# Altium project RD3399-20181013.PRJPCB
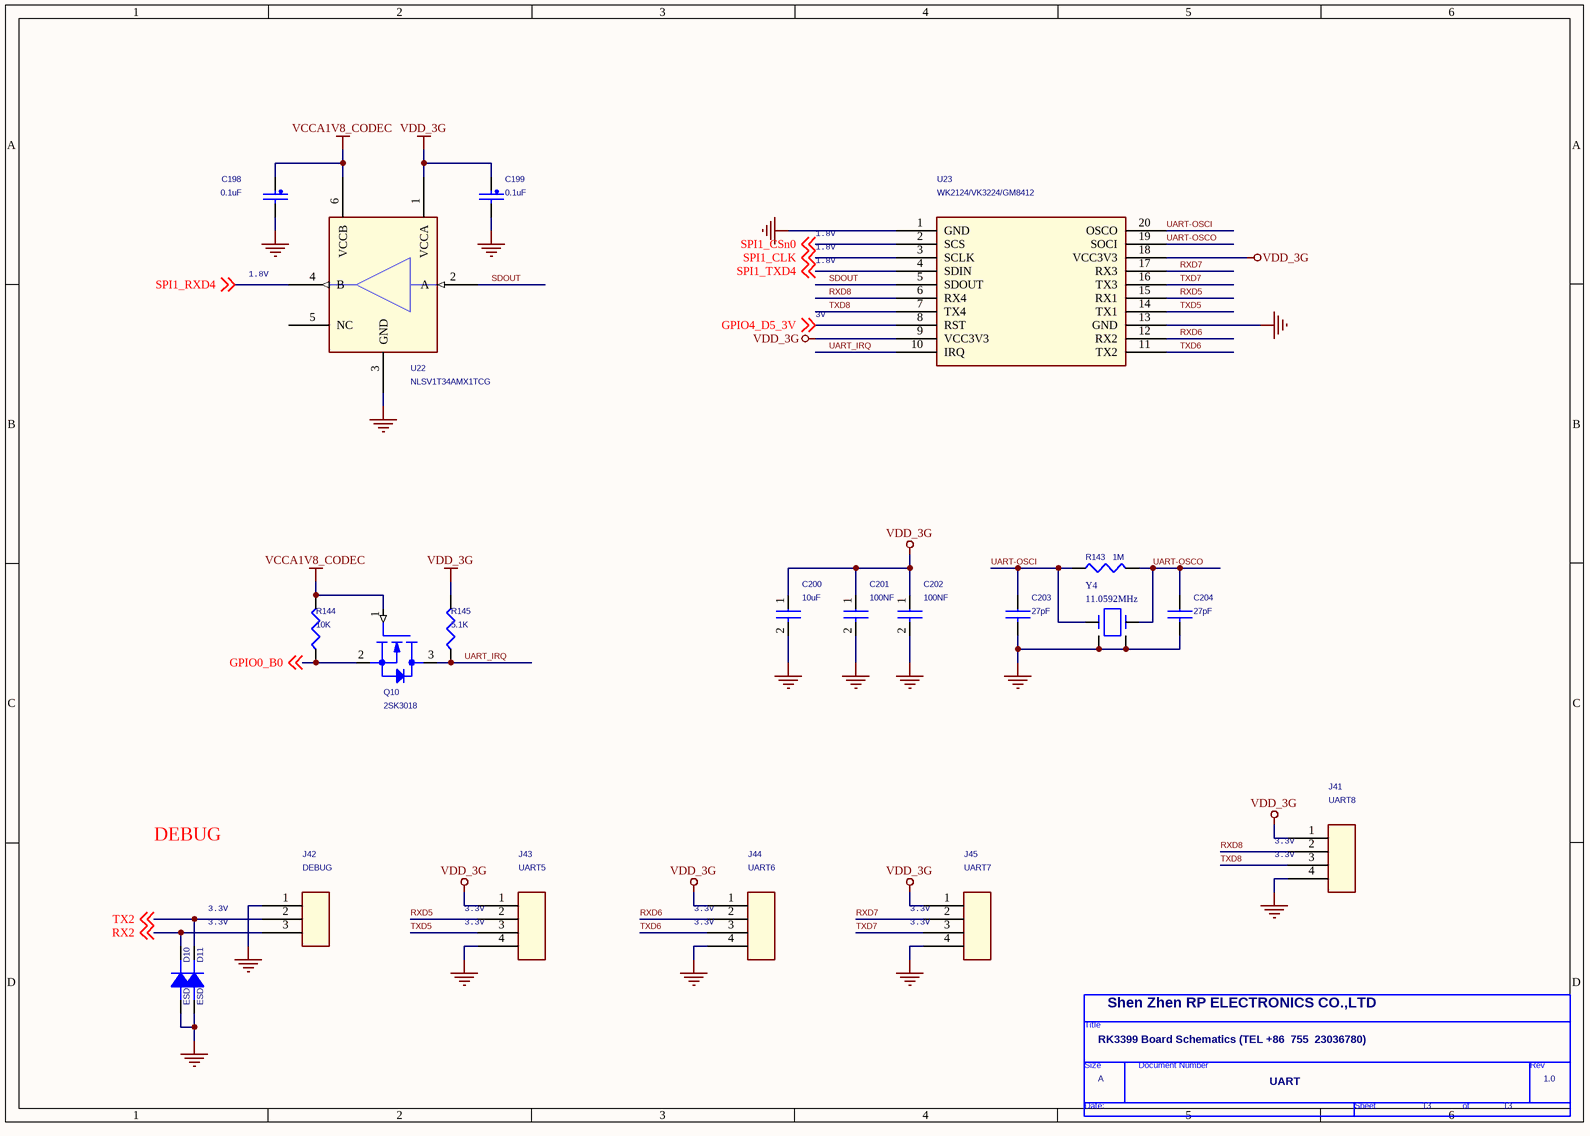
[diagram p0: 13.SchDoc]
7 sheets, 222 parts. Net scope: global (net labels, ports and power ports of the same name join across sheets).
Board file: RD3399-20181026.PCBDOC
Sheets:
  13.SchDoc
  09.SchDoc
  07.SchDoc
  04.SchDoc
  03.SchDoc
  02.SchDoc
  01.SchDoc

## Sheet 13.SchDoc
size 297 x 209 mm

### Parts
(Parts that share a designator on the sheet are numbered #1, #2 ... from top to bottom, then left to right.)
*#1  Doc: UART  RevCode: 1.0  Title: RK3399 Board Schematics (TEL +86  755  23036780)  Page Size: A  Page Number: 13  Cage Code: Shen Zhen RP ELECTRONICS CO.,LTD  (hidden comment: TitleBlock0)  (graphical)
C198  0.1uF  [0805C]
C199  0.1uF  [0805C]
C200  10uF  [0805C]
C201  100NF  [0805C]
C202  100NF  [0805C]
C203  27pF  [0805C]
C204  27pF  [0805C]
D10  ESD  [SOD-323]
D11  ESD  [SOD-323]
J41  UART8  [sip-4p-2d0]
J42  DEBUG  [SIP-3P-2D54-DEBUG]
J43  UART5  [sip-4p-2d0]
J44  UART6  [sip-4p-2d0]
J45  UART7  [sip-4p-2d0]
Q10  2SK3018  [SOT-23]
R143  1M  [0805]
R144  10K  [0805]
R145  5.1K  [0805]
U22  NLSV1T34AMX1TCG  [ullga6_1p45x1_0p5mm]
U23  WK2124/VK3224/GM8412  [WK2124]
Y4  11.0592MHz  [Y3025]

### Nets
GND: C198.2 C199.2 C200.2 C201.2 C202.2 C203.2 C204.2 D10.1(A) D11.1(A) J41.4 J42.1 J43.4 J44.4 J45.4 U22.3(GND) U23.1(GND) U23.13(GND) Y4.2 Y4.4
VCCA1V8_CODEC: C198.1 Q10.1(GATE) R144.1 U22.6(VCCB)
VDD_3G: C199.1 C200.1 C201.1 C202.1 J41.1 J43.1 J44.1 J45.1 R145.1 U22.1(VCCA) U23.9(VCC3V3) U23.18(VCC3V3)
GPIO0_B0: Q10.2(SOURCE) R144.2 ; off-sheet GPIO0_B0
GPIO4_D5_3V: U23.8(RST) ; off-sheet GPIO4_D5_3V
RX2: D10.2(K) J42.3 ; off-sheet RX2
RXD5: J43.2 U23.15(RX1)
RXD6: J44.2 U23.12(RX2)
RXD7: J45.2 U23.17(RX3)
RXD8: J41.2 U23.6(RX4)
SDOUT: U22.2(A) U23.5(SDOUT)
SPI1_CLK: U23.3(SCLK) ; off-sheet SPI1_CLK
SPI1_CSn0: U23.2(SCS) ; off-sheet SPI1_CSn0
SPI1_RXD4: U22.4(B) ; off-sheet SPI1_RXD4
SPI1_TXD4: U23.4(SDIN) ; off-sheet SPI1_TXD4
TX2: D11.2(K) J42.2 ; off-sheet TX2
TXD5: J43.3 U23.14(TX1)
TXD6: J44.3 U23.11(TX2)
TXD7: J45.3 U23.16(TX3)
TXD8: J41.3 U23.7(TX4)
UART-OSCI: C203.1 R143.2 U23.20(OSCO) Y4.1
UART-OSCO: C204.1 R143.1 U23.19(SOCI) Y4.3
UART_IRQ: Q10.3(DRAIN) R145.2 U23.10(IRQ)

Not connected (* = marked no-connect by the designer): U22 5(NC)

### Notes on the sheet
- 1.8V
- 3V
- DEBUG
- (near J41) 3.3V
- 3.3V
- (near J43) 3.3V
- (near J44) 3.3V
- (near J45) 3.3V
- (in symbol TitleBlock0) Title; Size; Document Number; Rev; Date:; Sheet; of

### Library data of the parts
C198 = CAP_NP: CAP CER 0.22UF 6.3V 20% X5R 0201; CLASS: DISCRETE; SIGNAL_MODEL: DEFAULT_CAPACITOR_220000pF_2_1; ROOM: CPU; AGILE_PN: 150-77852; MFG_NAME01: TAIYO YUDEN; MFG_PN01: JMK063BJ224MP-F; CAD_APPROVED: Yes; FPLIST: CC0201,CC0201_HD,0201_CC,cc_0201_cir; PRIORITY_PN: 021-00278; Tolerance: 20%; ROHS: Yes; HEIGHT: 0.33 MM; WVDC: 6.3V; VOLTAGE: 6.3V
C199 = CAP_NP: CAP CER 0.22UF 10V 20% X5R 0201; CLASS: DISCRETE; ROOM: CPU; AGILE_PN: 150-78815; MFG_NAME01: Taiyo Yuden; MFG_PN01: LMK063BJ224MP-F; CAD_APPROVED: Yes; FPLIST: CC0201,CC0201_HD,0201_CC,CC_0201_CIR,0201_CC_012SM; PRIORITY_PN: 021-00278; SIGNAL_MODEL: DEFAULT_CAPACITOR_220000pF_2_1; VOLTAGE: 10V; Tolerance: 20%; ROHS: Yes; HEIGHT: 0.33MM; WVDC: 10V
C200 = CAP NP_Dup2: cap,10.00uF,+/-10%,10V,X5R,C0805; Manufacturer: TDK; RK PN: C2012X5R1A106K125AB; Priority: A; Tolerance: 10%; Voltage: 10V; Dielectric: X5R; Part Type: C0805; Manufacturer PN: C2012X5R1A106K125AB; Created by: JJJ
C201 C202 = CAP NP_Dup2: cap,100.00nF,+/-10%,16V,X5R,C0402; Manufacturer PN: C1005X5R1C104K050BA; Manufacturer: TDK; Tolerance: 10%; Priority: A; Voltage: 16V; Dielectric: X5R; Created by: JJJ; Part Type: C0402; RK PN: C1005X5R1C104K050BA
C203 C204 = CAP NP_3_Dup1
D10 D11 = DIODE_Dup2
J41 J43-J45 = CON4
J42 = CON4_1
Q10 = 2N6756_0
R143 = RES_0
R144 R145 = R_Dup1
U22 = NLSV1T34: IC VXLTR 1 BIT DUAL-SUPPLY 0.9-4.5V 613AF; AGILE_PN: 312-79552; MFG_NAME01: On Semiconductor; CAD_APPROVED: Yes; CLASS: IC; MFG_PN01: NLSV1T34AMX1TCG; ROHS: Yes; HEIGHT: 0.4MM
Y4 = CRYSTAL_2
*#1 = TitleBlock0: Page Create Date: March  8, 1995; Page Count: 13

## Sheet 09.SchDoc
size 513 x 386 mm
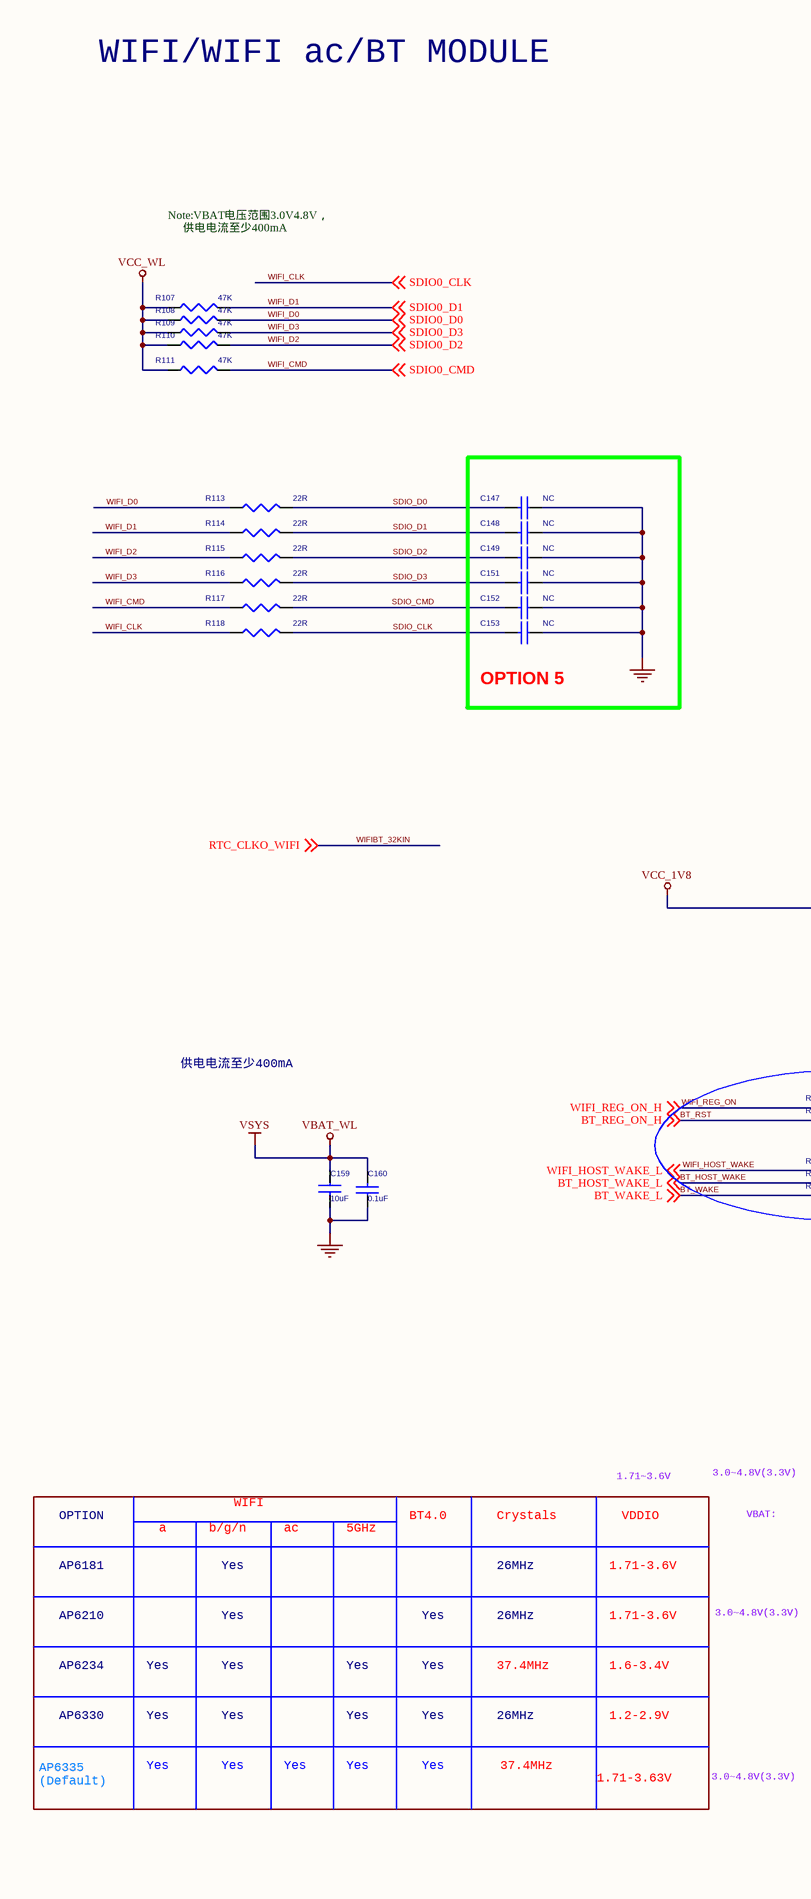
[diagram p1: 09.SchDoc, left]
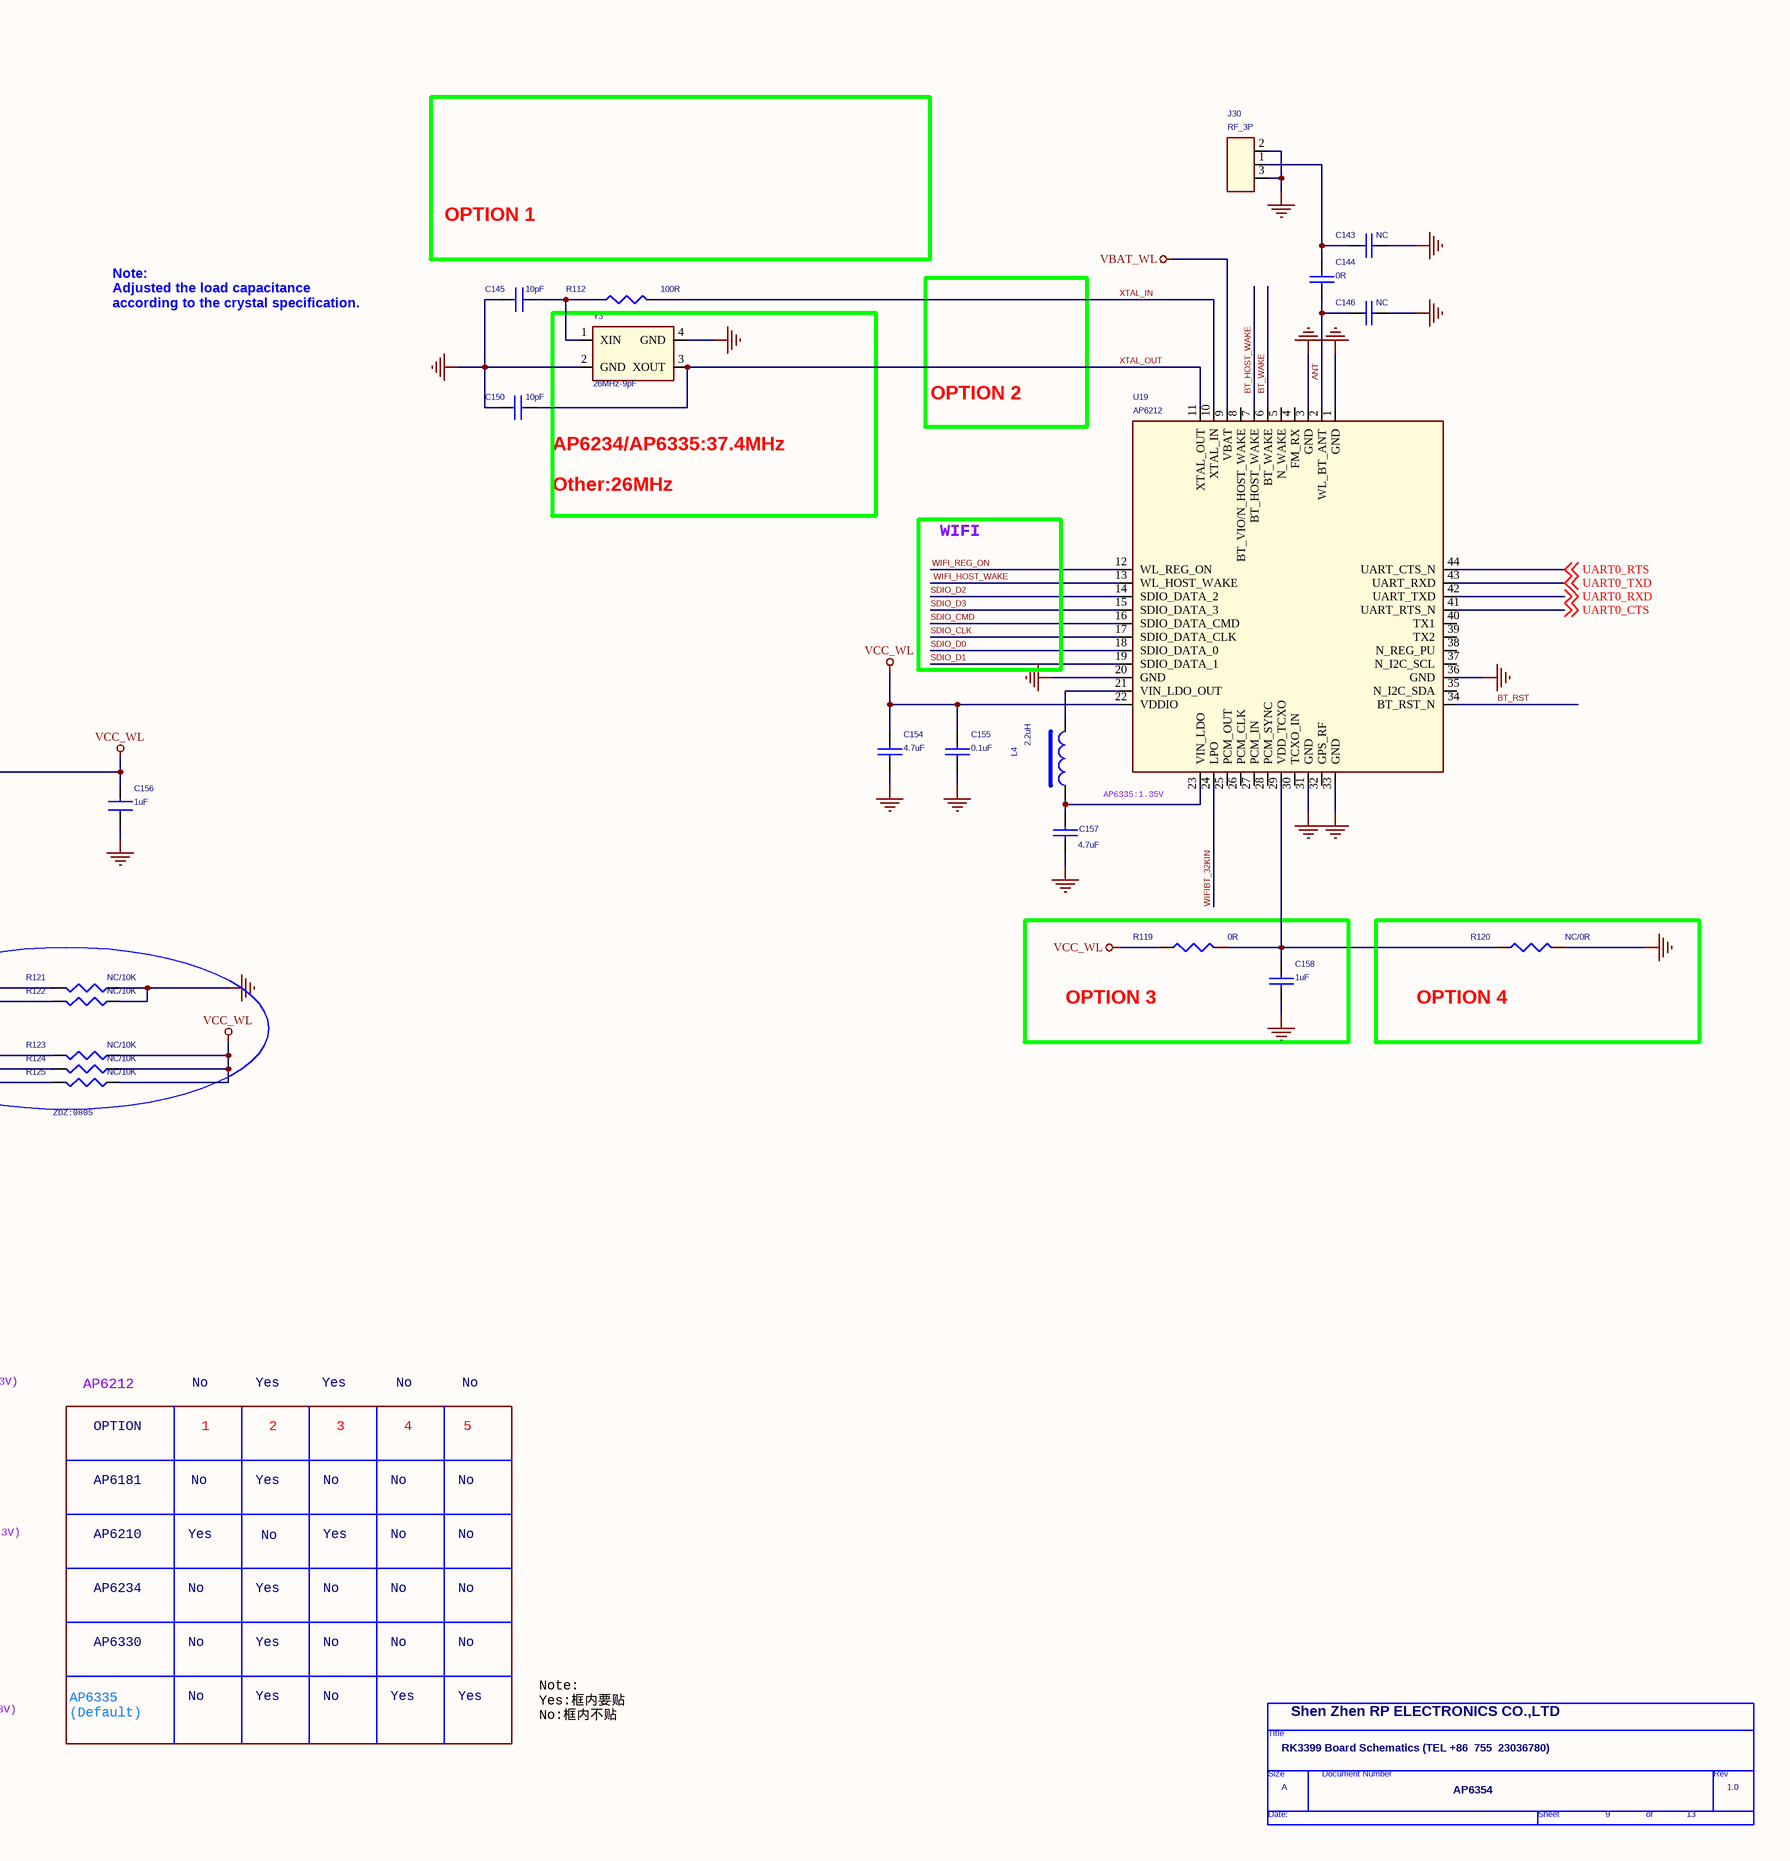
[diagram p2: 09.SchDoc, right]

### Parts
(Parts that share a designator on the sheet are numbered #1, #2 ... from top to bottom, then left to right.)
*#2  Doc: AP6354  RevCode: 1.0  Title: RK3399 Board Schematics (TEL +86  755  23036780)  Page Size: A  Page Number: 9  Page Count: 13  Cage Code: Shen Zhen RP ELECTRONICS CO.,LTD  (hidden comment: TitleBlock0)  (graphical)
C143  NC  [0805C]
C144  0R  [0805C]
C145  10pF  [0805C]
C146  NC  [0805C]
C147  NC  [0805C]
C148  NC  [0805C]
C149  NC  [0805C]
C150  10pF  [0805C]
C151  NC  [0805C]
C152  NC  [0805C]
C153  NC  [0805C]
C154  4.7uF  [0805C]
C155  0.1uF  [0805C]
C156  1uF  [0805C]
C157  4.7uF  [0805C]
C158  1uF  [0805C]
C159  10uF  [0805C]
C160  0.1uF  [0805C]
J30  RF_3P  [ANT-2]
L4  2.2uH  [IND2520]
R107  47K  [0805]
R108  47K  [0805]
R109  47K  [0805]
R110  47K  [0805]
R111  47K  [0805]
R112  100R  [0805]
R113  22R  [0805]
R114  22R  [0805]
R115  22R  [0805]
R116  22R  [0805]
R117  22R  [0805]
R118  22R  [0805]
R119  0R  [0805]
R120  NC/0R  [0805]
R121  NC/10K  [0805]
R122  NC/10K  [0805]
R123  NC/10K  [0805]
R124  NC/10K  [0805]
R125  NC/10K  [0805]
U19  AP6212  [AP6XXX]
Y3  26MHz-9pF  [CRY-3225]

### Blocks framed on the sheet
OPTION 5: C147-C149 C151-C153
OPTION 3: C158 R119
OPTION 4: R120

### Nets
GND: C143.2 C145.2 C146.2 C147.1 C148.1 C149.1 C150.1 C151.1 C152.1 C153.1 C154.1 C155.1 C156.2 C157.1 C158.1 C159.2 C160.1 J30.2 J30.3 R120.1 R121.1 R122.1 U19.1(GND) U19.3(GND) U19.20(GND) U19.31(GND) U19.33(GND) U19.36(GND) Y3.2(GND) Y3.4(GND)
VBAT_WL: C159.1 C160.2 U19.9(VBAT)  [also labelled VSYS]
VCC_1V8: C154.2 C155.2 C156.1 R107.1 R108.1 R109.1 R110.1 R111.1 R119.2 R123.1 R124.1 R125.1 U19.22(VDDIO)  [also labelled VCC_WL]
ANT: C144.1 C146.1 U19.2(WL_BT_ANT)
BT_HOST_WAKE: R124.2 U19.7(BT_HOST_WAKE) ; off-sheet BT_HOST_WAKE_L  [also labelled BT_HOST_WAKE_L]
BT_RST: R122.2 U19.34(BT_RST_N) ; off-sheet BT_REG_ON_H  [also labelled BT_REG_ON_H]
BT_WAKE: R125.2 U19.6(BT_WAKE) ; off-sheet BT_WAKE_L  [also labelled BT_WAKE_L]
SDIO_CLK: C153.2 R118.2 U19.17(SDIO_DATA_CLK)
SDIO_CMD: C152.2 R117.2 U19.16(SDIO_DATA_CMD)
SDIO_D0: C147.2 R113.2 U19.18(SDIO_DATA_0)
SDIO_D1: C148.2 R114.2 U19.19(SDIO_DATA_1)
SDIO_D2: C149.2 R115.2 U19.14(SDIO_DATA_2)
SDIO_D3: C151.2 R116.2 U19.15(SDIO_DATA_3)
UART0_CTS: U19.41(UART_RTS_N) ; off-sheet UART0_CTS
UART0_RTS: U19.44(UART_CTS_N) ; off-sheet UART0_RTS
UART0_RXD: U19.42(UART_TXD) ; off-sheet UART0_RXD
UART0_TXD: U19.43(UART_RXD) ; off-sheet UART0_TXD
WIFI_CLK: R118.1 ; off-sheet SDIO0_CLK  [also labelled SDIO0_CLK]
WIFI_CMD: R111.2 R117.1 ; off-sheet SDIO0_CMD  [also labelled SDIO0_CMD]
WIFI_D0: R108.2 R113.1 ; off-sheet SDIO0_D0  [also labelled SDIO0_D0]
WIFI_D1: R107.2 R114.1 ; off-sheet SDIO0_D1  [also labelled SDIO0_D1]
WIFI_D2: R110.2 R115.1 ; off-sheet SDIO0_D2  [also labelled SDIO0_D2]
WIFI_D3: R109.2 R116.1 ; off-sheet SDIO0_D3  [also labelled SDIO0_D3]
WIFI_HOST_WAKE: R123.2 U19.13(WL_HOST_WAKE) ; off-sheet WIFI_HOST_WAKE_L  [also labelled WIFI_HOST_WAKE_L]
WIFI_REG_ON: R121.2 U19.12(WL_REG_ON) ; off-sheet WIFI_REG_ON_H  [also labelled WIFI_REG_ON_H]
WIFIBT_32KIN: U19.24(LPO) ; off-sheet RTC_CLKO_WIFI  [also labelled RTC_CLKO_WIFI]
XTAL_IN: R112.2 U19.10(XTAL_IN)
XTAL_OUT: C150.2 U19.11(XTAL_OUT) Y3.3(XOUT)
NetC143_1: C143.1 C144.2 J30.1
NetC145_1: C145.1 R112.1 Y3.1(XIN)
NetC157_2: C157.2 L4.1 U19.23(VIN_LDO)
NetC158_2: C158.2 R119.1 R120.2 U19.29(VDD_TCXO)
NetL4_2: L4.2 U19.21(VIN_LDO_OUT)

Not connected (* = marked no-connect by the designer): U19 4(FM_RX) 5(N_WAKE) 8(BT_VIO/N_HOST_WAKE) 25(PCM_OUT) 26(PCM_CLK) 27(PCM_IN) 28(PCM_SYNC) 30(TCXO_IN) 32(GPS_RF) 35(N_I2C_SDA) 37(N_I2C_SCL) 38(N_REG_PU) 39(TX2) 40(TX1)

### Notes on the sheet
- WIFI/WIFI ac/BT MODULE
- Note:VBAT电压范围3.0V4.8V，
  供电电流至少400mA
- OPTION 1
- (near C145) Note:
  Adjusted the load capacitance
  according to the crystal specification.
- OPTION 2
- Other:26MHz
- (near C150) AP6234/AP6335:37.4MHz
- WIFI
- (near U19) AP6335:1.35V
- 供电电流至少400mA
- ZDZ:0805
- 1.71~3.6V
- 3.0~4.8V(3.3V)
- AP6212
- No
- Yes
- OPTION
- a
- b/g/n
- ac
- 5GHz
- BT4.0
- Crystals
- VDDIO
- VBAT:
- 1
- 2
- 3
- 4
- 5
- AP6181
- 26MHz
- 1.71-3.6V
- AP6234
- AP6210
- 37.4MHz
- 1.6-3.4V
- AP6330
- 1.2-2.9V
- AP6335
  (Default)
- 1.71-3.63V
- Note:
  Yes:框内要贴
  No:框内不贴
- (in symbol TitleBlock0) Title; Size; Document Number; Rev; Date:; Sheet; of

### Library data of the parts
C143 C144 C146 C154 C155 C157 C158 = CAPNP_Dup1_1
C145 C150 = CAP NP: CAP,MLCC,8pF,+/-0.5pF,NPO,6.3V,SMD0402
C147-C149 C151-C153 C160 = CAP NP: CAP,MLCC,100nF,+/-10%,X7R,6.3V,SMD0402; Supplier: MURATA; Supplier P/N: GRM21BR61C106K
C156 = CAP NP_Dup6: CAP,MLCC,100nF,+/-10%,X7R,6.3V,SMD0402
C159 = CAP NP: CAP,MLCC,4.7uF,+/-10%,X5R,6.3V,SMD0603; Supplier P/N: GRM21BR61C106K; Supplier: MURATA
J30 = CON3_1
L4 = INDUCTOR_1_Dup1: CoilInd,Shielded(SHLD),2.2uH@100KHz,+/-30%,1.09A,110mOhm,SMD,3.0*3.0*1.0; ROOM: USB+5V
R107-R111 = RESISTOR_Dup2: ROHS CHIP RES 10K 1/16W +/-5%
R112 = R_0
R113-R120 = RESISTOR_Dup2: RES,thick film,33Ohm,+/-5%,1/16W,SMD0402
R121-R125 = RESISTOR_1
U19 = AP6493_1: Device: AMPAK_SIP; QVL: AMPAK; ORCAD_LIB: MODULE
Y3 = CRYSTAL-4_4: Crystal,37.400MHz,+/-20ppm,12pF,SMD3225,-10°C ~ +60   °C
*#2 = TitleBlock0: Page Create Date: March  8, 1995

## Sheet 07.SchDoc
size 297 x 209 mm
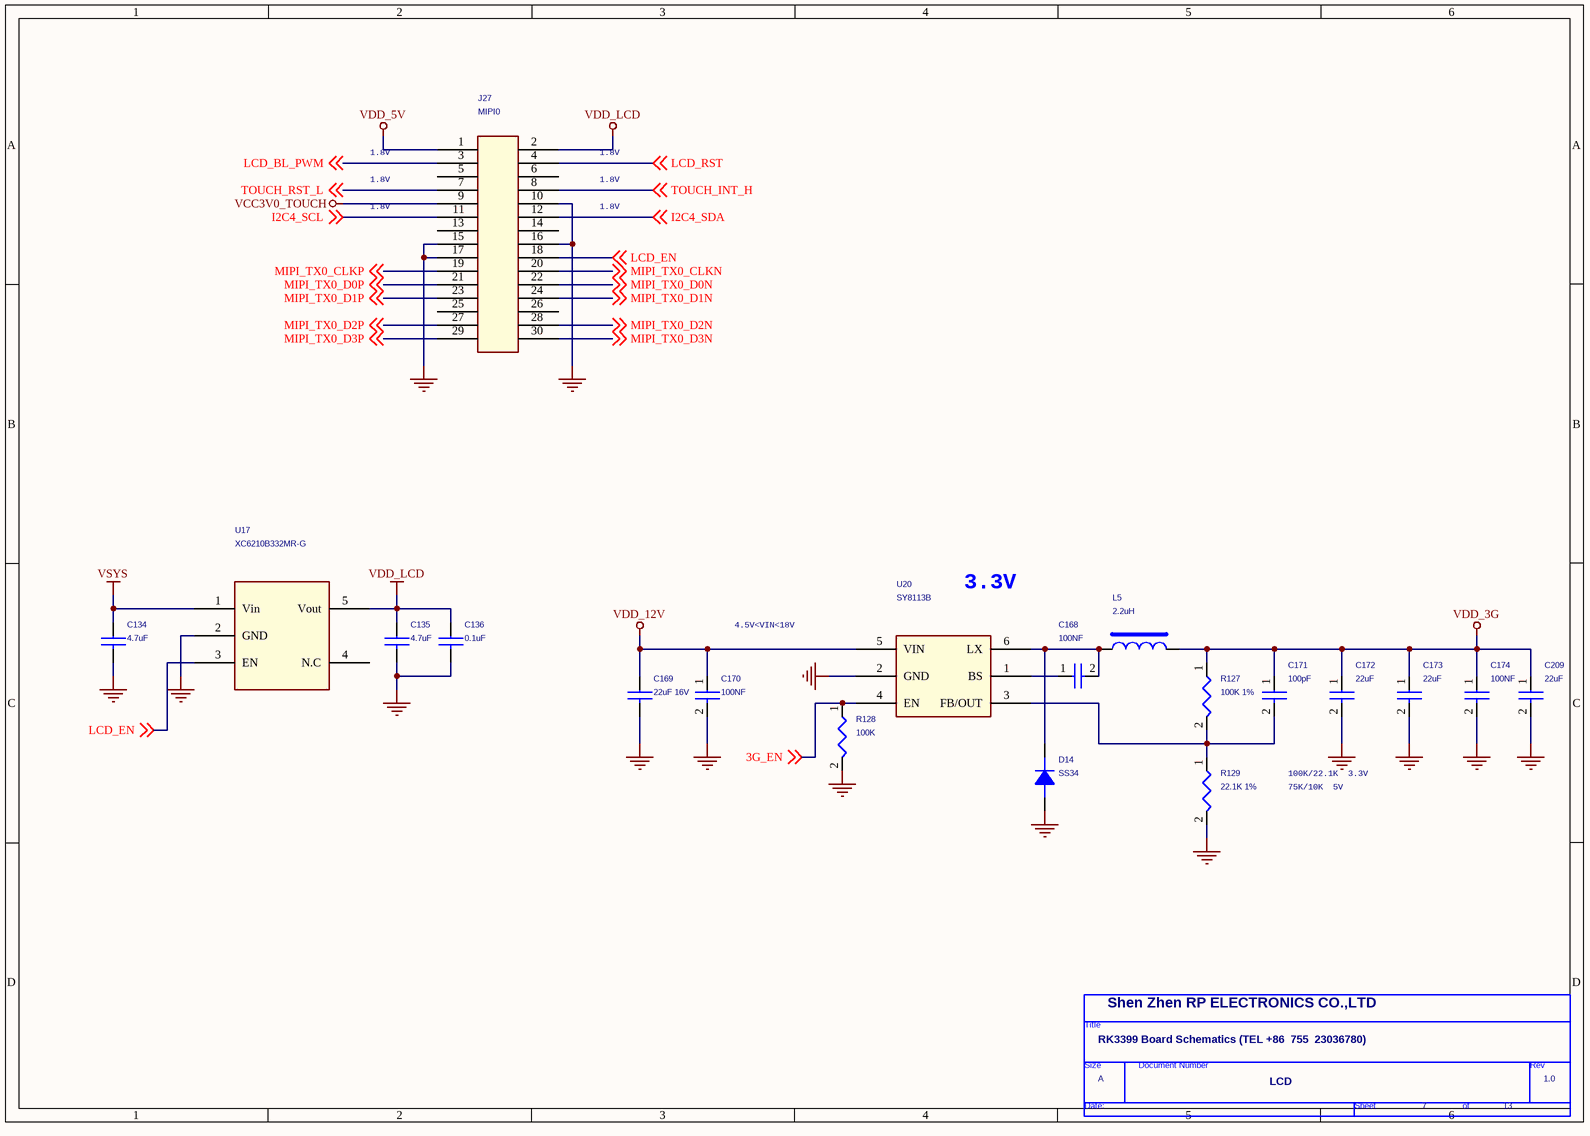
[diagram p3: 07.SchDoc]

### Parts
(Parts that share a designator on the sheet are numbered #1, #2 ... from top to bottom, then left to right.)
*#3  Doc: LCD  RevCode: 1.0  Title: RK3399 Board Schematics (TEL +86  755  23036780)  Page Size: A  Page Number: 7  Page Count: 13  Cage Code: Shen Zhen RP ELECTRONICS CO.,LTD  (hidden comment: TitleBlock0)  (graphical)
C134  4.7uF  [0805C]
C135  4.7uF  [0805C]
C136  0.1uF  [0805C]
C168  100NF  [0805C]
C169  22uF 16V  [3216C]
C170  100NF  [0805C]
C171  100pF  [0805C]
C172  22uF  [0805C]
C173  22uF  [0805C]
C174  100NF  [0805C]
C209  22uF  [0805C]
D14  SS34  [DO-214AC]
J27  MIPI0  [idc30p-2d0]
L5  2.2uH  [l5d18]
R127  100K 1%  [0805]
R128  100K  [0805]
R129  22.1K 1%  [0805]
U17  XC6210B332MR-G  [SOT23-5]
U20  SY8113B  [SOT23-6]

### Nets
GND: C134.2 C135.2 C136.2 C169.2 C170.2 C172.2 C173.2 C174.2 C209.2 D14.1(A) J27.10 J27.15 J27.16 J27.17 R128.2 R129.2 U17.2(GND) U20.2(GND)
VCC3V0_TOUCH: J27.9
VDD_3G: C171.1 C172.1 C173.1 C174.1 C209.1 L5.2 R127.1
VDD_5V: J27.1  [project net HUB_5V]
VDD_12V: C169.1 C170.1 U20.5(VIN)
VDD_LCD: C135.1 C136.1 J27.2 U17.5(Vout)
VSYS: C134.1 U17.1(Vin)  [project net VBAT_WL]
3G_EN: R128.1 U20.4(EN) ; off-sheet 3G_EN
I2C4_SCL: J27.11 ; off-sheet I2C4_SCL
I2C4_SDA: J27.12 ; off-sheet I2C4_SDA
LCD_BL_PWM: J27.3 ; off-sheet LCD_BL_PWM
LCD_EN: J27.18 U17.3(EN) ; off-sheet LCD_EN
LCD_RST: J27.4 ; off-sheet LCD_RST
MIPI_TX0_CLKN: J27.20 ; off-sheet MIPI_TX0_CLKN
MIPI_TX0_CLKP: J27.19 ; off-sheet MIPI_TX0_CLKP
MIPI_TX0_D0N: J27.22 ; off-sheet MIPI_TX0_D0N
MIPI_TX0_D0P: J27.21 ; off-sheet MIPI_TX0_D0P
MIPI_TX0_D1N: J27.24 ; off-sheet MIPI_TX0_D1N
MIPI_TX0_D1P: J27.23 ; off-sheet MIPI_TX0_D1P
MIPI_TX0_D2N: J27.28 ; off-sheet MIPI_TX0_D2N
MIPI_TX0_D2P: J27.27 ; off-sheet MIPI_TX0_D2P
MIPI_TX0_D3N: J27.30 ; off-sheet MIPI_TX0_D3N
MIPI_TX0_D3P: J27.29 ; off-sheet MIPI_TX0_D3P
TOUCH_INT_H: J27.8 ; off-sheet TOUCH_INT_H  [project net GPIO1_C6]
TOUCH_RST_L: J27.7 ; off-sheet TOUCH_RST_L
NetC168_1: C168.1 U20.1(BS)
NetC168_2: C168.2 D14.2(K) L5.1 U20.6(LX)
NetC171_2: C171.2 R127.2 R129.1 U20.3(FB/OUT)

Not connected (* = marked no-connect by the designer): J27 5 6 13 14 25 26; U17 4(N.C)

### Notes on the sheet
- 1.8V
- 3.3V
- 4.5V<VIN<18V
- 100K/22.1K  3.3V
- 75K/10K  5V
- (in symbol TitleBlock0) Title; Size; Document Number; Rev; Date:; Sheet; of

### Library data of the parts
C134-C136 C169 = CAP NP_Dup8
C168 = CAP NP_Dup2: cap,100.00nF,+/-10%,25V,X5R,C0402; Manufacturer: TDK; RK PN: C1005X5R1E104K050BC; Priority: A; Tolerance: 10%; Voltage: 25V; Dielectric: X5R; Part Type: C0402; Manufacturer PN: C1005X5R1E104K050BC; Created by: JJJ
C170 = CAP NP_Dup2: cap,100.00nF,+/-10%,25V,X5R,C0402; Manufacturer PN: C1005X5R1E104K050BC; Manufacturer: TDK; Tolerance: 10%; Priority: A; Voltage: 25V; Dielectric: X5R; Created by: JJJ; Part Type: C0402; RK PN: C1005X5R1E104K050BC
C171 = CAP NP_Dup2: cap,100.00pF,+/-5%,50V,C0G,C0402; Manufacturer PN: C1005C0G1H101J050BA; Manufacturer: TDK; Tolerance: 5%; Priority: A; Voltage: 50V; Dielectric: C0G; Created by: JJJ; Part Type: C0402; RK PN: C1005C0G1H101J050BA
C172 C209 = CAP NP_Dup2: cap,22.00uF,+/-10%,10V,X5R,C0805; Manufacturer PN: C2012X5R1A226K125AB; Manufacturer: TDK; Tolerance: 10%; Priority: A; Voltage: 10V; Dielectric: X5R; Created by: JJJ; Part Type: C0805; RK PN: C2012X5R1A226K125AB
C173 = CAP NP_Dup2: cap,10.00uF,+/-10%,10V,X5R,C0805; Manufacturer PN: C2012X5R1A106K125AB; Manufacturer: TDK; Tolerance: 10%; Priority: A; Voltage: 10V; Dielectric: X5R; Created by: JJJ; Part Type: C0805; RK PN: C2012X5R1A106K125AB
C174 = CAP NP_Dup2: as C201 on sheet 13; Voltage: 16V; Dielectric: X5R; Created by: JJJ; Part Type: C0402; RK PN: C1005X5R1C104K050BA
D14 = DIODE_Dup1
J27 = CON20_5
L5 = INDUCTORS OF FERRITE: Power Inductor,3.3uH,0.2,IND_404030; Manufacturer PN: SWPA4030S3R3MT; Manufacturer: sunlord; DC Resistor: 0.04ohm; Isat: 3.3A; Resonace frequency: 38M; Irms: 2.4A; Tolerance: 20%; Priority: A; Created by: YTL; Part Type: POWER_IND; RK PN: SWPA4030S3R3MT
R127 = RESISTOR_Dup1: 通用厚膜电阻,75K,+/-1%,R0402,1/16W.; Manufacturer: YAGEO; RK PN: RC0402FR-0775KL; Priority: A; Wattage: 1/16W; Tolerance: 1%; Part Type: 通用厚膜电阻; Manufacturer PN: RC0402FR-0775KL; Created by: YTL
R128 = RESISTOR_Dup1: 通用厚膜电阻,10K,+/-1%,R0402,1/16W.; Manufacturer: YAGEO; Tolerance: 1%; RK PN: RC0402FR-0710KL; Priority: A; Wattage: 1/16W; Part Type: 通用厚膜电阻; Manufacturer PN: RC0402FR-0710KL; Created by: YTL
R129 = RESISTOR_Dup1: 通用厚膜电阻,10K,+/-1%,R0402,1/16W.; Manufacturer PN: RC0402FR-0710KL; Manufacturer: YAGEO; Wattage: 1/16W; Priority: A; Tolerance: 1%; Created by: YTL; Part Type: 通用厚膜电阻; RK PN: RC0402FR-0710KL
U17 = XC6219_2
U20 = DCDC_SY8113: Manufacturer: Silergy（矽力杰）; Priority: A; Created by: JJJ; Manufacturer PN: SY8113B; Part Type: DCDC; RK PN: SY8113B
*#3 = TitleBlock0: Page Create Date: March  8, 1995

## Sheet 04.SchDoc
size 420 x 297 mm
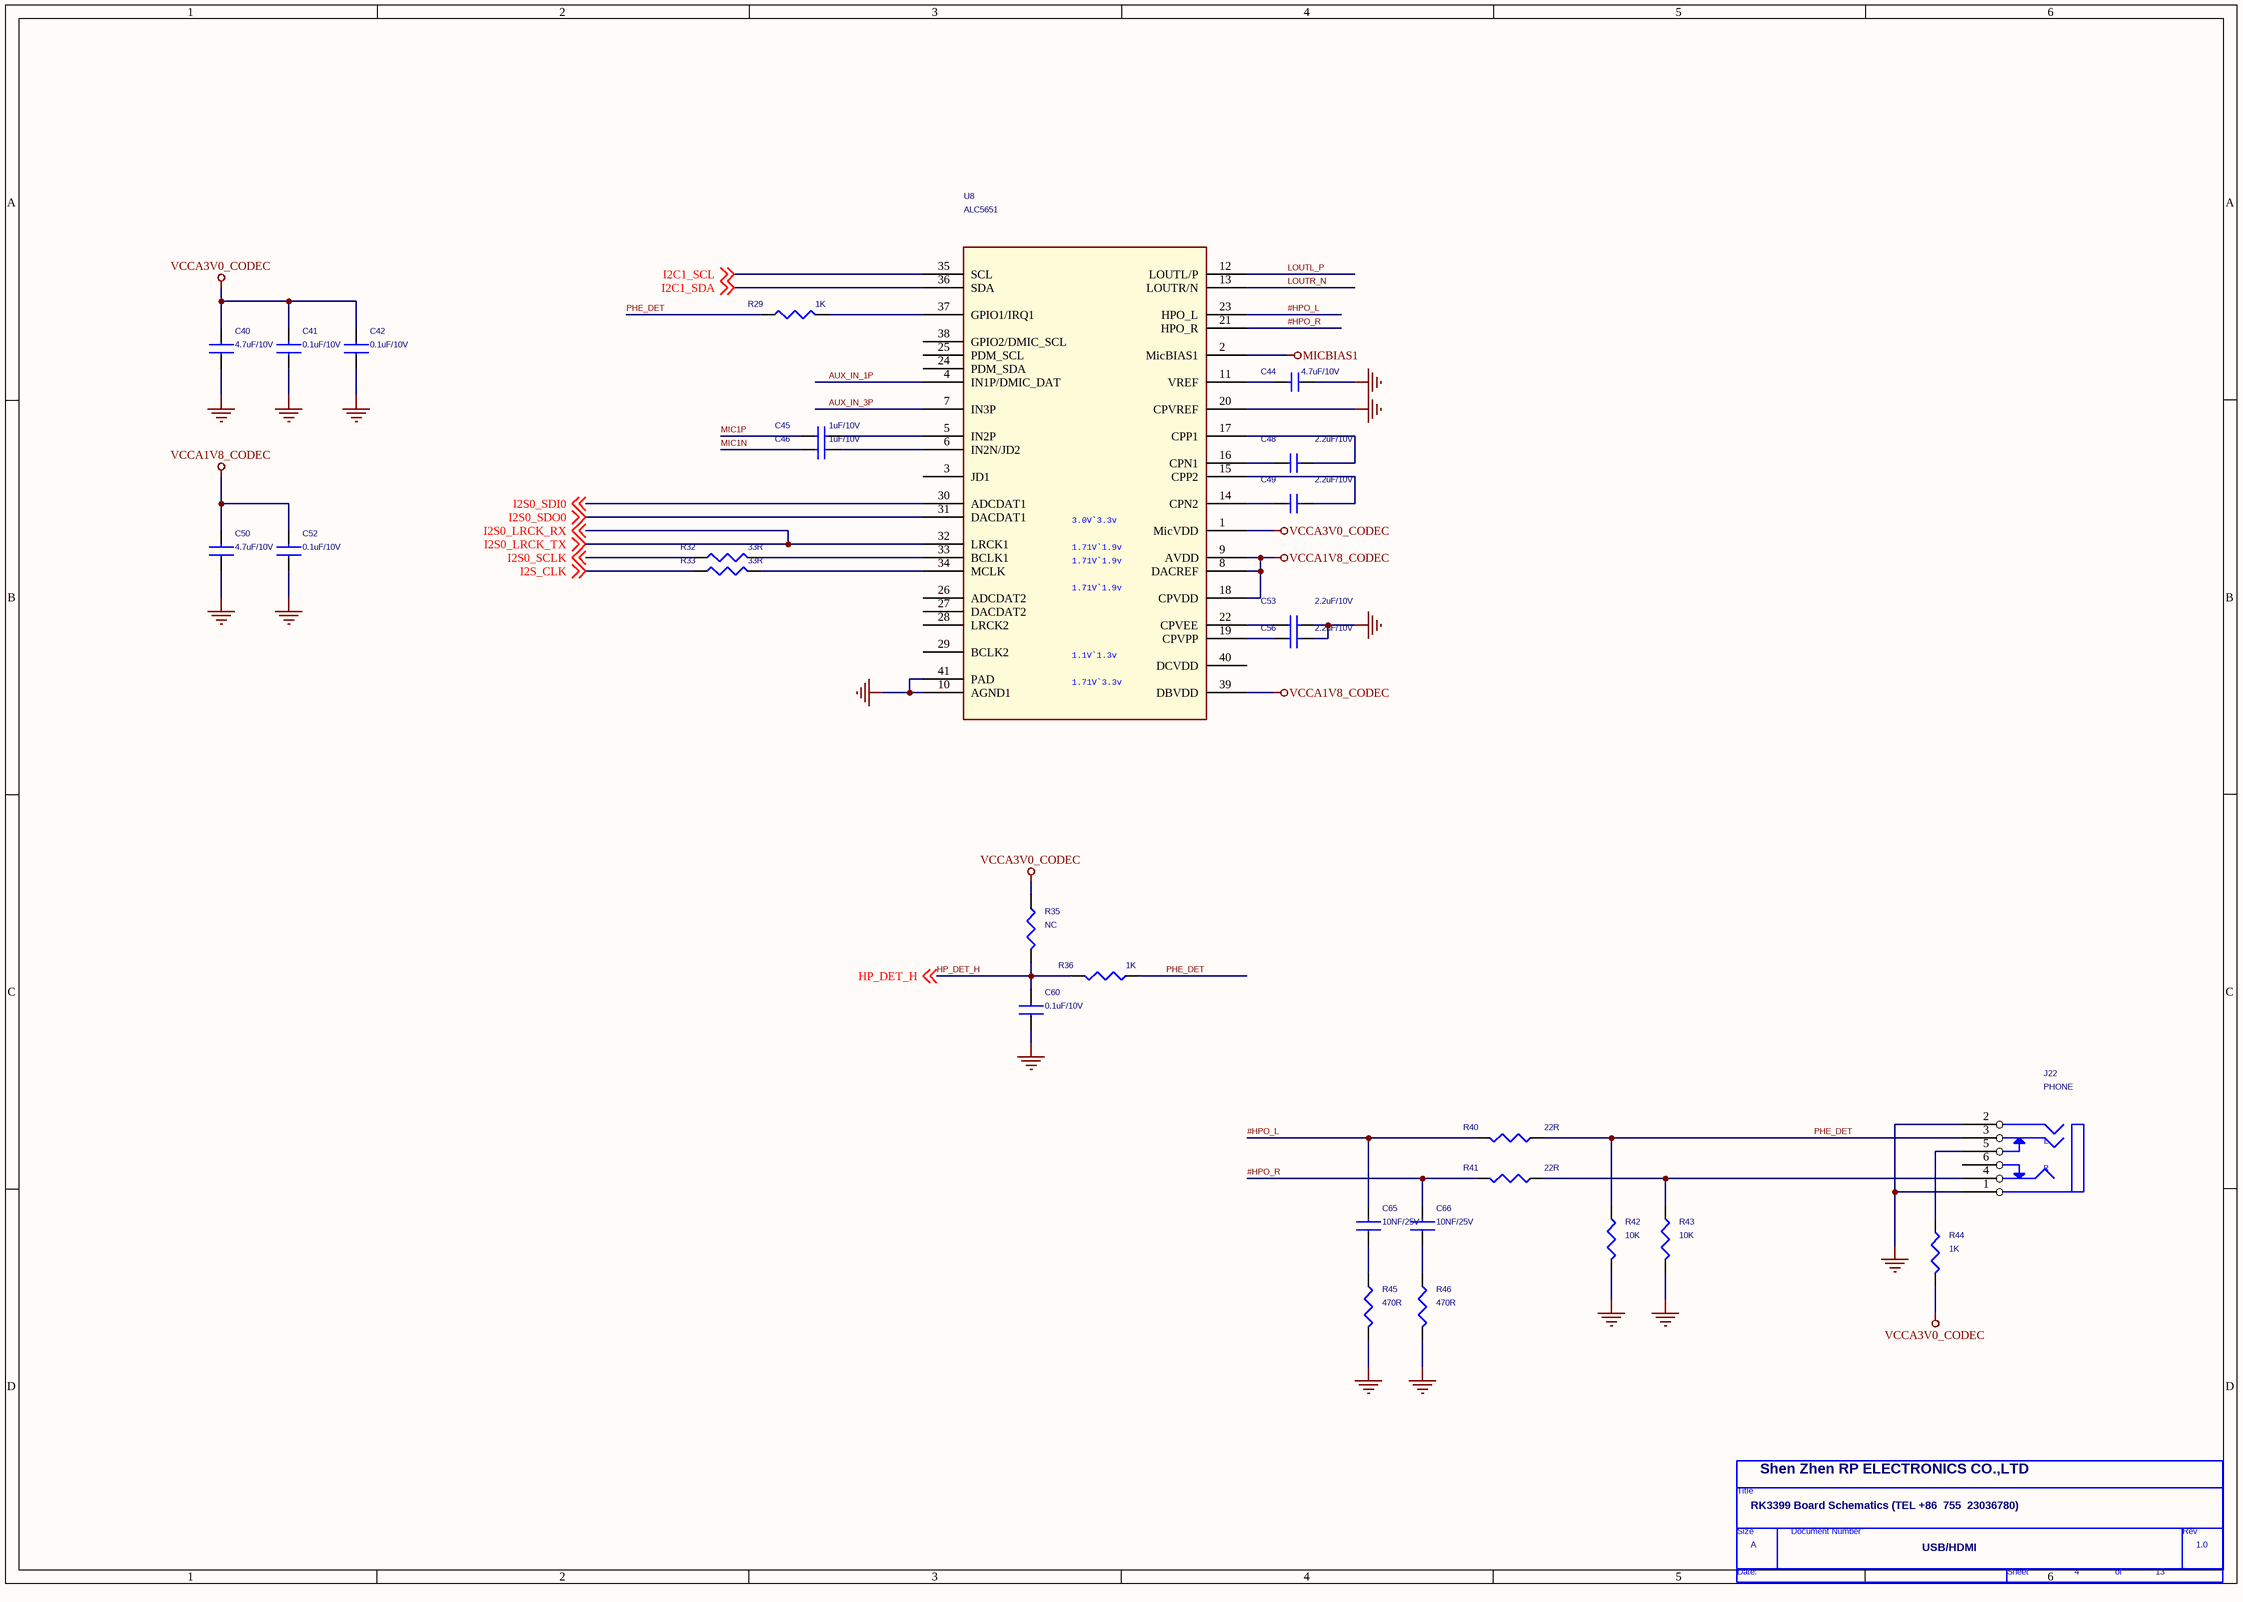
[diagram p4: 04.SchDoc]

### Parts
(Parts that share a designator on the sheet are numbered #1, #2 ... from top to bottom, then left to right.)
*#4  Doc: USB/HDMI  RevCode: 1.0  Title: RK3399 Board Schematics (TEL +86  755  23036780)  Page Size: A  Page Number: 4  Page Count: 13  Cage Code: Shen Zhen RP ELECTRONICS CO.,LTD  (hidden comment: TitleBlock0)  (graphical)
C40  4.7uF/10V  [0805C]
C41  0.1uF/10V  [0805C]
C42  0.1uF/10V  [0805C]
C44  4.7uF/10V  [0805C]
C45  1uF/10V  [0805C]
C46  1uF/10V  [0805C]
C48  2.2uF/10V  [0805C]
C49  2.2uF/10V  [0805C]
C50  4.7uF/10V  [0805C]
C52  0.1uF/10V  [0805C]
C53  2.2uF/10V  [0805C]
C56  2.2uF/10V  [0805C]
C60  0.1uF/10V  [0805C]
C65  10NF/25V  [0805C]
C66  10NF/25V  [0805C]
J22  PHONE  [PJ-3537]
R29  1K  [0805]
R32  33R  [0805]
R33  33R  [0805]
R35  NC  [0805]
R36  1K  [0805]
R40  22R  [0805]
R41  22R  [0805]
R42  10K  [0805]
R43  10K  [0805]
R44  1K  [0805]
R45  470R  [0805]
R46  470R  [0805]
U8  ALC5651  [QFN40-0.5]

### Nets
GND: C40.2 C41.2 C42.2 C44.1 C50.2 C52.2 C53.2 C56.2 C60.2 J22.1(E) J22.2 R42.2 R43.2 R45.2 R46.2 U8.10(AGND1) U8.20(CPVREF) U8.41(PAD)
MICBIAS1: U8.2(MicBIAS1)
VCCA1V8_CODEC: C50.1 C52.1 U8.8(DACREF) U8.9(AVDD) U8.18(CPVDD) U8.39(DBVDD)
VCCA3V0_CODEC: C40.1 C41.1 C42.1 R35.1 R44.2 U8.1(MicVDD)
#HPO_L: C65.2 R40.2 U8.23(HPO_L)
#HPO_R: C66.2 R41.2 U8.21(HPO_R)
AUX_IN_1P: U8.4(IN1P/DMIC_DAT)
AUX_IN_3P: U8.7(IN3P)
HP_DET_H: C60.1 R35.2 R36.2 ; off-sheet HP_DET_H
I2C1_SCL: U8.35(SCL) ; off-sheet I2C1_SCL
I2C1_SDA: U8.36(SDA) ; off-sheet I2C1_SDA
I2S0_LRCK_RX: U8.32(LRCK1) ; off-sheet I2S0_LRCK_TX, off-sheet I2S0_LRCK_RX  [also labelled I2S0_LRCK_TX]
I2S0_SCLK: R32.1 ; off-sheet I2S0_SCLK
I2S0_SDI0: U8.30(ADCDAT1) ; off-sheet I2S0_SDI0
I2S0_SDO0: U8.31(DACDAT1) ; off-sheet I2S0_SDO0
I2S_CLK: R33.1 ; off-sheet I2S_CLK
LOUTL_P: U8.12(LOUTL/P)
LOUTR_N: U8.13(LOUTR/N)
MIC1N: C46.1
MIC1P: C45.1
PHE_DET: J22.3(A) R29.1 R36.1 R40.1 R42.1
NetC44_2: C44.2 U8.11(VREF)
NetC45_2: C45.2 U8.5(IN2P)
NetC46_2: C46.2 U8.6(IN2N/JD2)
NetC48_1: C48.1 U8.16(CPN1)
NetC48_2: C48.2 U8.17(CPP1)
NetC49_1: C49.1 U8.14(CPN2)
NetC49_2: C49.2 U8.15(CPP2)
NetC53_1: C53.1 U8.22(CPVEE)
NetC56_1: C56.1 U8.19(CPVPP)
NetC65_1: C65.1 R45.1
NetC66_1: C66.1 R46.1
NetJ22_4: J22.4(D) R41.1 R43.1
NetJ22_5: J22.5(B) R44.1
NetR29_2: R29.2 U8.37(GPIO1/IRQ1)
NetR32_2: R32.2 U8.33(BCLK1)
NetR33_2: R33.2 U8.34(MCLK)

Not connected (* = marked no-connect by the designer): J22 6(C); U8 3(JD1) 24(PDM_SDA) 25(PDM_SCL) 26(ADCDAT2) 27(DACDAT2) 28(LRCK2) 29(BCLK2) 38(GPIO2/DMIC_SCL) 40(DCVDD)

### Notes on the sheet
- (in symbol ALC5651_3) 3.0V`3.3v; 1.71V`1.9v; 1.1V`1.3v; 1.71V`3.3v
- (in symbol PHONEJACK STEREO SW_2) L; R
- (in symbol TitleBlock0) Title; Size; Document Number; Rev; Date:; Sheet; of

### Library data of the parts
C40-C42 C50 C52 C60 = CAP NP_Dup6: RoHS CHIP CAP 0.1uF +10/-10% X7R
C44 = SMALL CAP: CAP,MLCC,4.7uF,+/-10%,X5R,6.3V,SMD0603
C45 C46 = SMALL CAP: CAP,MLCC,1uF,+/-10%,X5R,6.3V,SMD0402
C48 C49 C53 C56 = SMALL CAP: CAP,MLCC,2.2uF,+/-10%,X5R,6.3V,SMD0603; Supplier: MURATA; Supplier P/N: GRM188R61C225KE15
C65 C66 = CAP NP_Dup6: RoHS CHIP CAP 0.47uF +10/-10% X5R
J22 = PHONEJACK STEREO SW_2
R29 R32 R33 = RESISTOR: ROHS CHIP RES 33R 1/16W 5%
R35 = RESISTOR: ROHS CHIP RES 1K 1/16W 5%; Option: DNP
R36 = RESISTOR: ROHS CHIP RES 1K 1/16W 5%
R40 R41 = RES 1B: ROHS CHIP RES 22Ohm 1/16W +/-5%
R42-R46 = RES 1B: ROHS CHIP RES 470Ohm 1/16W +/-5%
U8 = ALC5651_3
*#4 = TitleBlock0: Page Create Date: March  8, 1995

## Sheet 03.SchDoc
size 420 x 297 mm
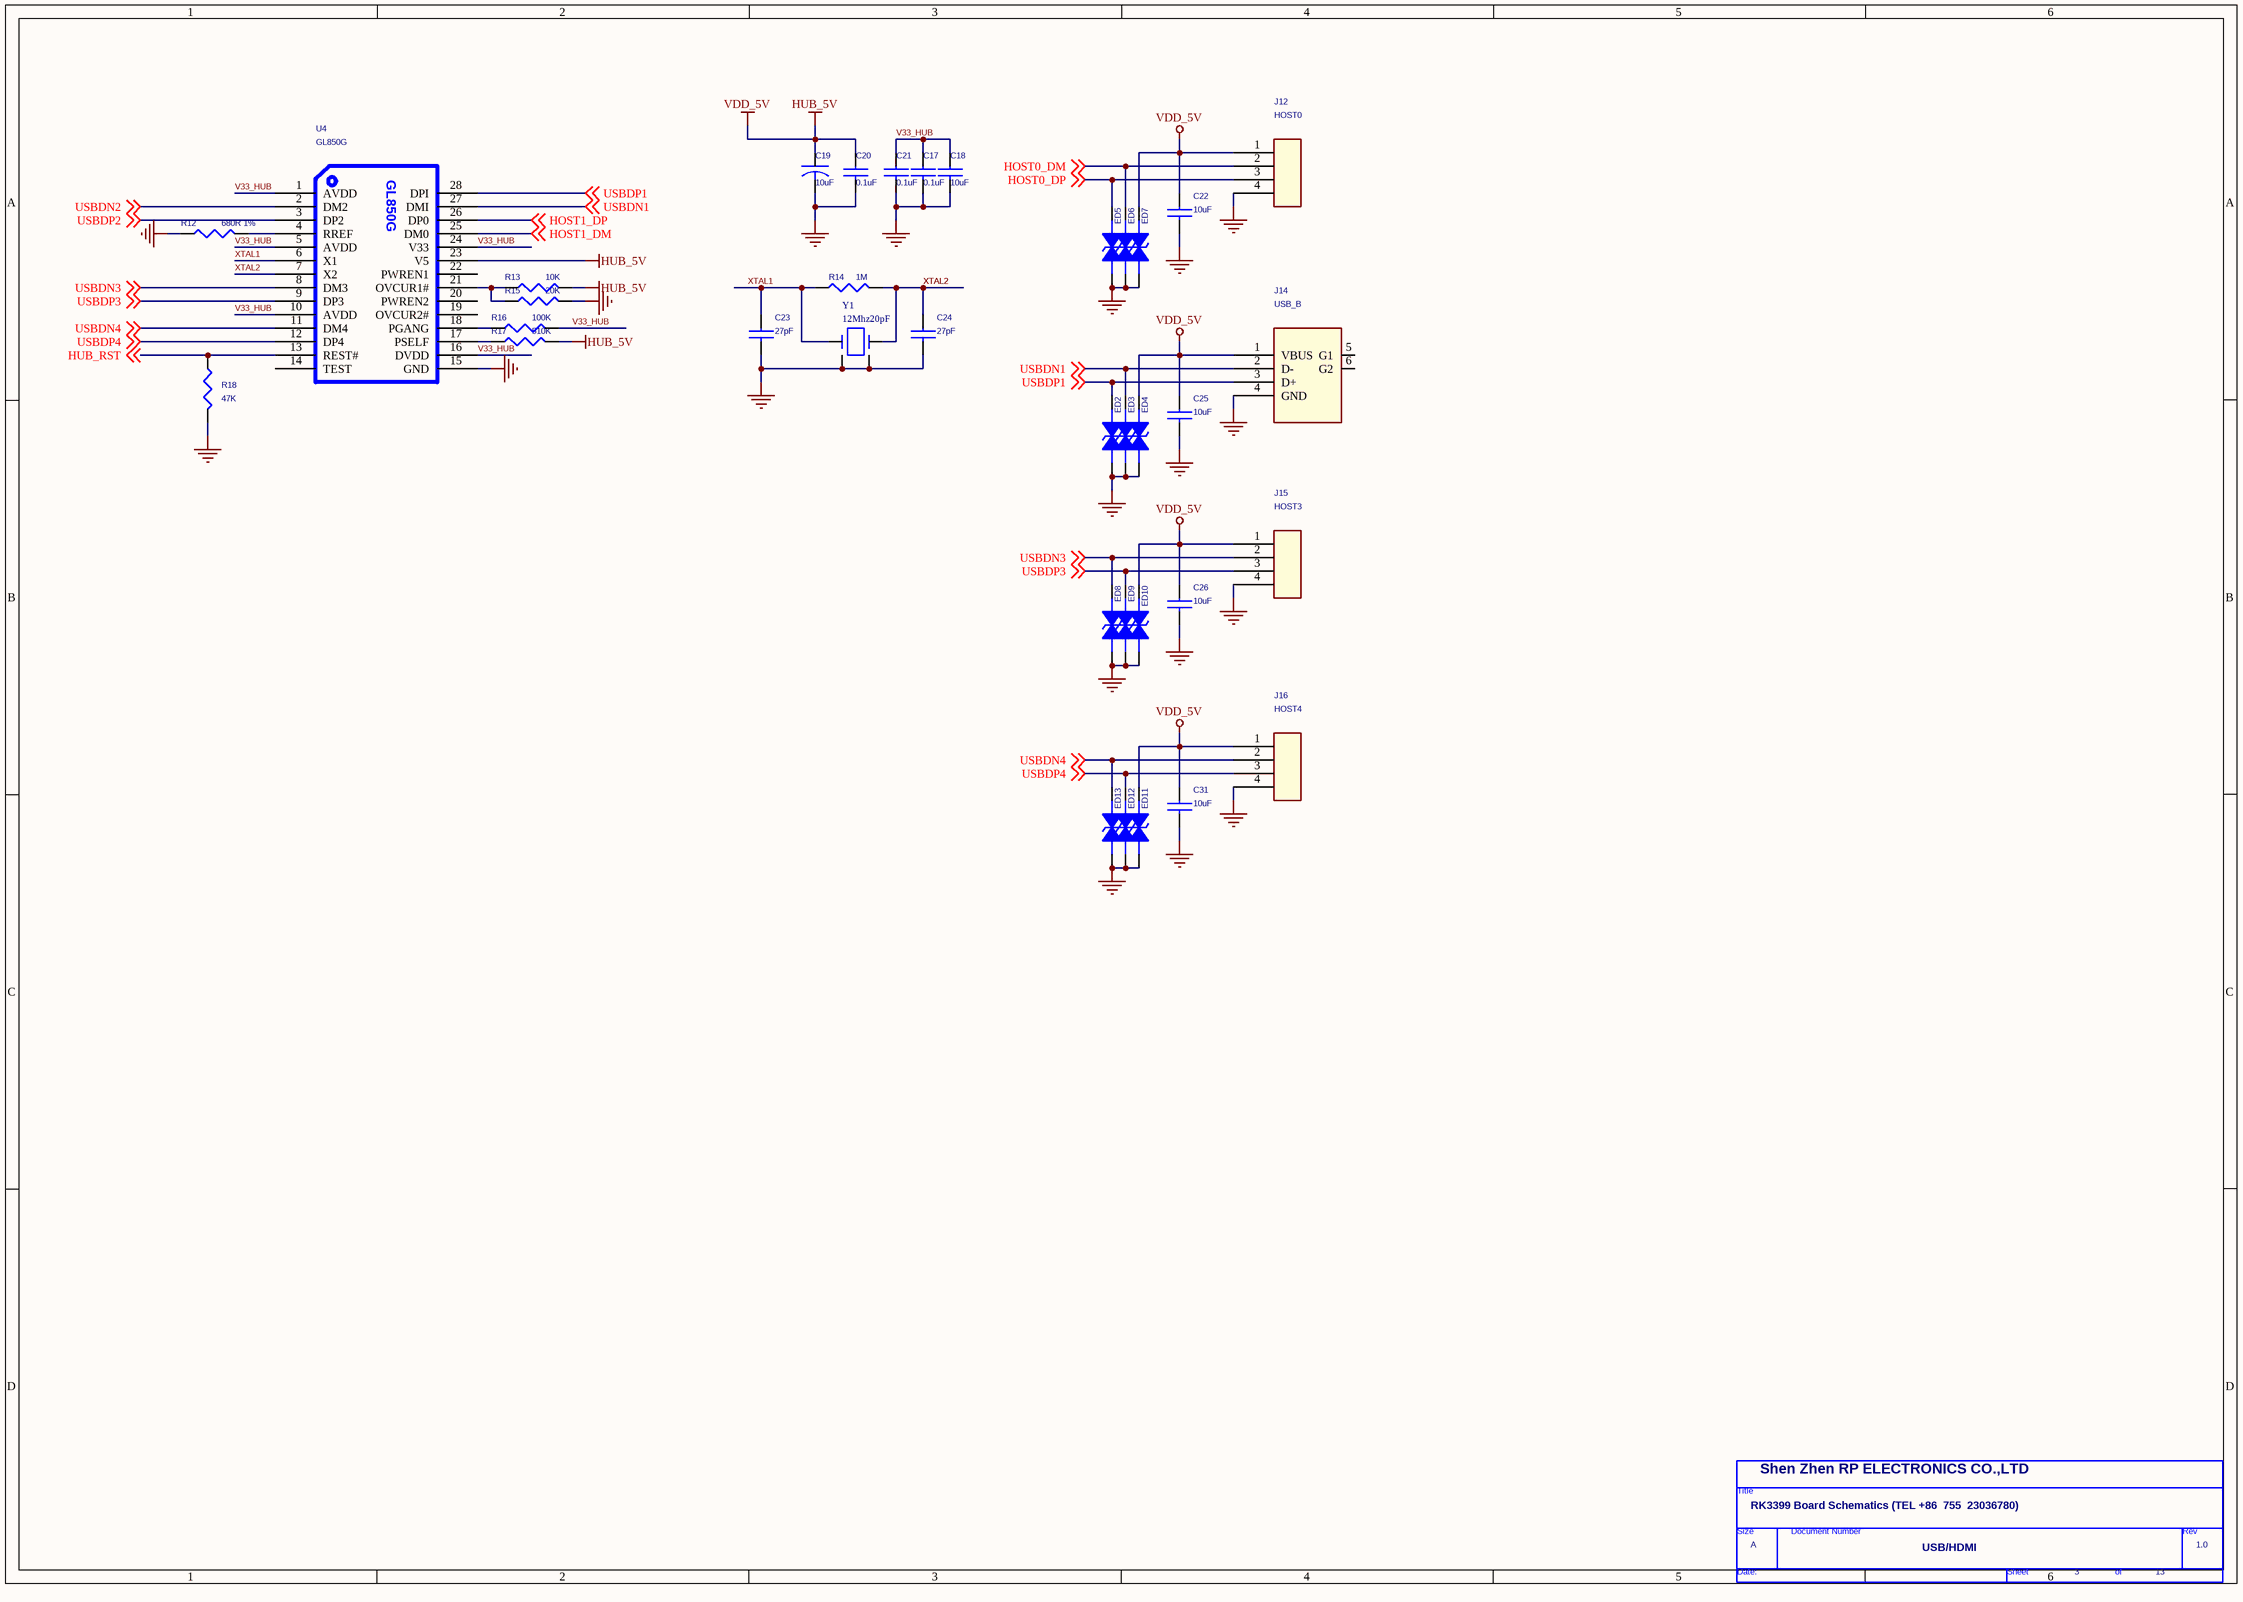
[diagram p5: 03.SchDoc]

### Parts
(Parts that share a designator on the sheet are numbered #1, #2 ... from top to bottom, then left to right.)
*#5  Doc: USB/HDMI  RevCode: 1.0  Title: RK3399 Board Schematics (TEL +86  755  23036780)  Page Size: A  Page Number: 3  Page Count: 13  Cage Code: Shen Zhen RP ELECTRONICS CO.,LTD  (hidden comment: TitleBlock0)  (graphical)
C17  0.1uF  [0805C]
C18  10uF  [0805C]
C19  10uF  [0805C]
C20  0.1uF  [0805C]
C21  0.1uF  [0805C]
C22  10uF  [0805C]
C23  27pF  [0805C]
C24  27pF  [0805C]
C25  10uF  [0805C]
C26  10uF  [0805C]
C31  10uF  [0805C]
ED2  ESD  [SOD-323]  (value not drawn)
ED3  ESD  [SOD-323]  (value not drawn)
ED4  ESD  [SOD-323]  (value not drawn)
ED5  ESD  [SOD-323]  (value not drawn)
ED6  ESD  [SOD-323]  (value not drawn)
ED7  ESD  [SOD-323]  (value not drawn)
ED8  ESD  [SOD-323]  (value not drawn)
ED9  ESD  [SOD-323]  (value not drawn)
ED10  ESD  [SOD-323]  (value not drawn)
ED11  ESD  [SOD-323]  (value not drawn)
ED12  ESD  [SOD-323]  (value not drawn)
ED13  ESD  [SOD-323]  (value not drawn)
J12  HOST0  [USB-A]
J14  USB_B  [USB-A]
J15  HOST3  [USB-A]
J16  HOST4  [USB-A]
R12  680R 1%  [0805]
R13  10K  [0805]
R14  1M  [0805]
R15  20K  [0805]
R16  100K  [0805]
R17  510K  [0805]
R18  47K  [0805]
U4  GL850G  [GL850G]
Y1  12Mhz20pF  [Y3025]

### Nets
GND: C17.2 C18.2 C19.2 C20.2 C21.2 C22.2 C23.2 C24.2 C25.2 C26.2 C31.2 ED2.2 ED3.2 ED4.2 ED5.2 ED6.2 ED7.2 ED8.2 ED9.2 ED10.2 ED11.2 ED12.2 ED13.2 J12.4 J14.4(GND) J15.4 J16.4 R12.1 R15.2 R18.2 U4.15(GND) Y1.2 Y1.4
HUB_5V: C19.1 C20.1 C22.1 C25.1 C26.1 C31.1 ED4.1 ED7.1 ED10.1 ED11.1 J12.1 J14.1(VBUS) J15.1 J16.1 R13.2 R17.2 U4.23(V5)  [also labelled VDD_5V]
HOST0_DM: ED6.1 J12.2 ; off-sheet HOST0_DM
HOST0_DP: ED5.1 J12.3 ; off-sheet HOST0_DP
HOST1_DM: U4.25(DM0) ; off-sheet HOST1_DM
HOST1_DP: U4.26(DP0) ; off-sheet HOST1_DP
HUB_RST: R18.1 U4.13(REST#) ; off-sheet HUB_RST
USBDN1: ED3.1 J14.2(D-) U4.27(DMI) ; off-sheet USBDN1
USBDN2: U4.2(DM2) ; off-sheet USBDN2
USBDN3: ED8.1 J15.2 U4.8(DM3) ; off-sheet USBDN3
USBDN4: ED13.1 J16.2 U4.11(DM4) ; off-sheet USBDN4
USBDP1: ED2.1 J14.3(D+) U4.28(DPI) ; off-sheet USBDP1
USBDP2: U4.3(DP2) ; off-sheet USBDP2
USBDP3: ED9.1 J15.3 U4.9(DP3) ; off-sheet USBDP3
USBDP4: ED12.1 J16.3 U4.12(DP4) ; off-sheet USBDP4
V33_HUB: C17.1 C18.1 C21.1 R16.2 U4.1(AVDD) U4.5(AVDD) U4.10(AVDD) U4.16(DVDD) U4.24(V33)
XTAL1: C23.1 R14.2 U4.6(X1) Y1.1
XTAL2: C24.1 R14.1 U4.7(X2) Y1.3
NetR12_2: R12.2 U4.4(RREF)
NetR13_1: R13.1 R15.1 U4.21(OVCUR1#)
NetR16_1: R16.1 U4.18(PGANG)
NetR17_1: R17.1 U4.17(PSELF)

Not connected (* = marked no-connect by the designer): J14 5(G1) 6(G2); U4 14(TEST) 19(OVCUR2#) 20(PWREN2) 22(PWREN1)

### Notes on the sheet
- (in symbol TitleBlock0) Title; Size; Document Number; Rev; Date:; Sheet; of

### Library data of the parts
C17 C18 C20 C21 = CAP NP_Dup5
C19 = CAP_Dup1
C22 C25 C26 C31 = CAP NP_Dup8
C23 C24 = CAP NP_3_Dup1
ED2-ED13 = DIODE BI-DIR TRIG
J12 J15 J16 = CON4
J14 = USB_A_1
R12 = 01RES
R13 R15-R18 = R_1
R14 = RES_0
U4 = FE1_1s_SSOP28_1
Y1 = CRYSTAL_2
*#5 = TitleBlock0: Page Create Date: March  8, 1995

## Sheet 02.SchDoc
size 420 x 297 mm
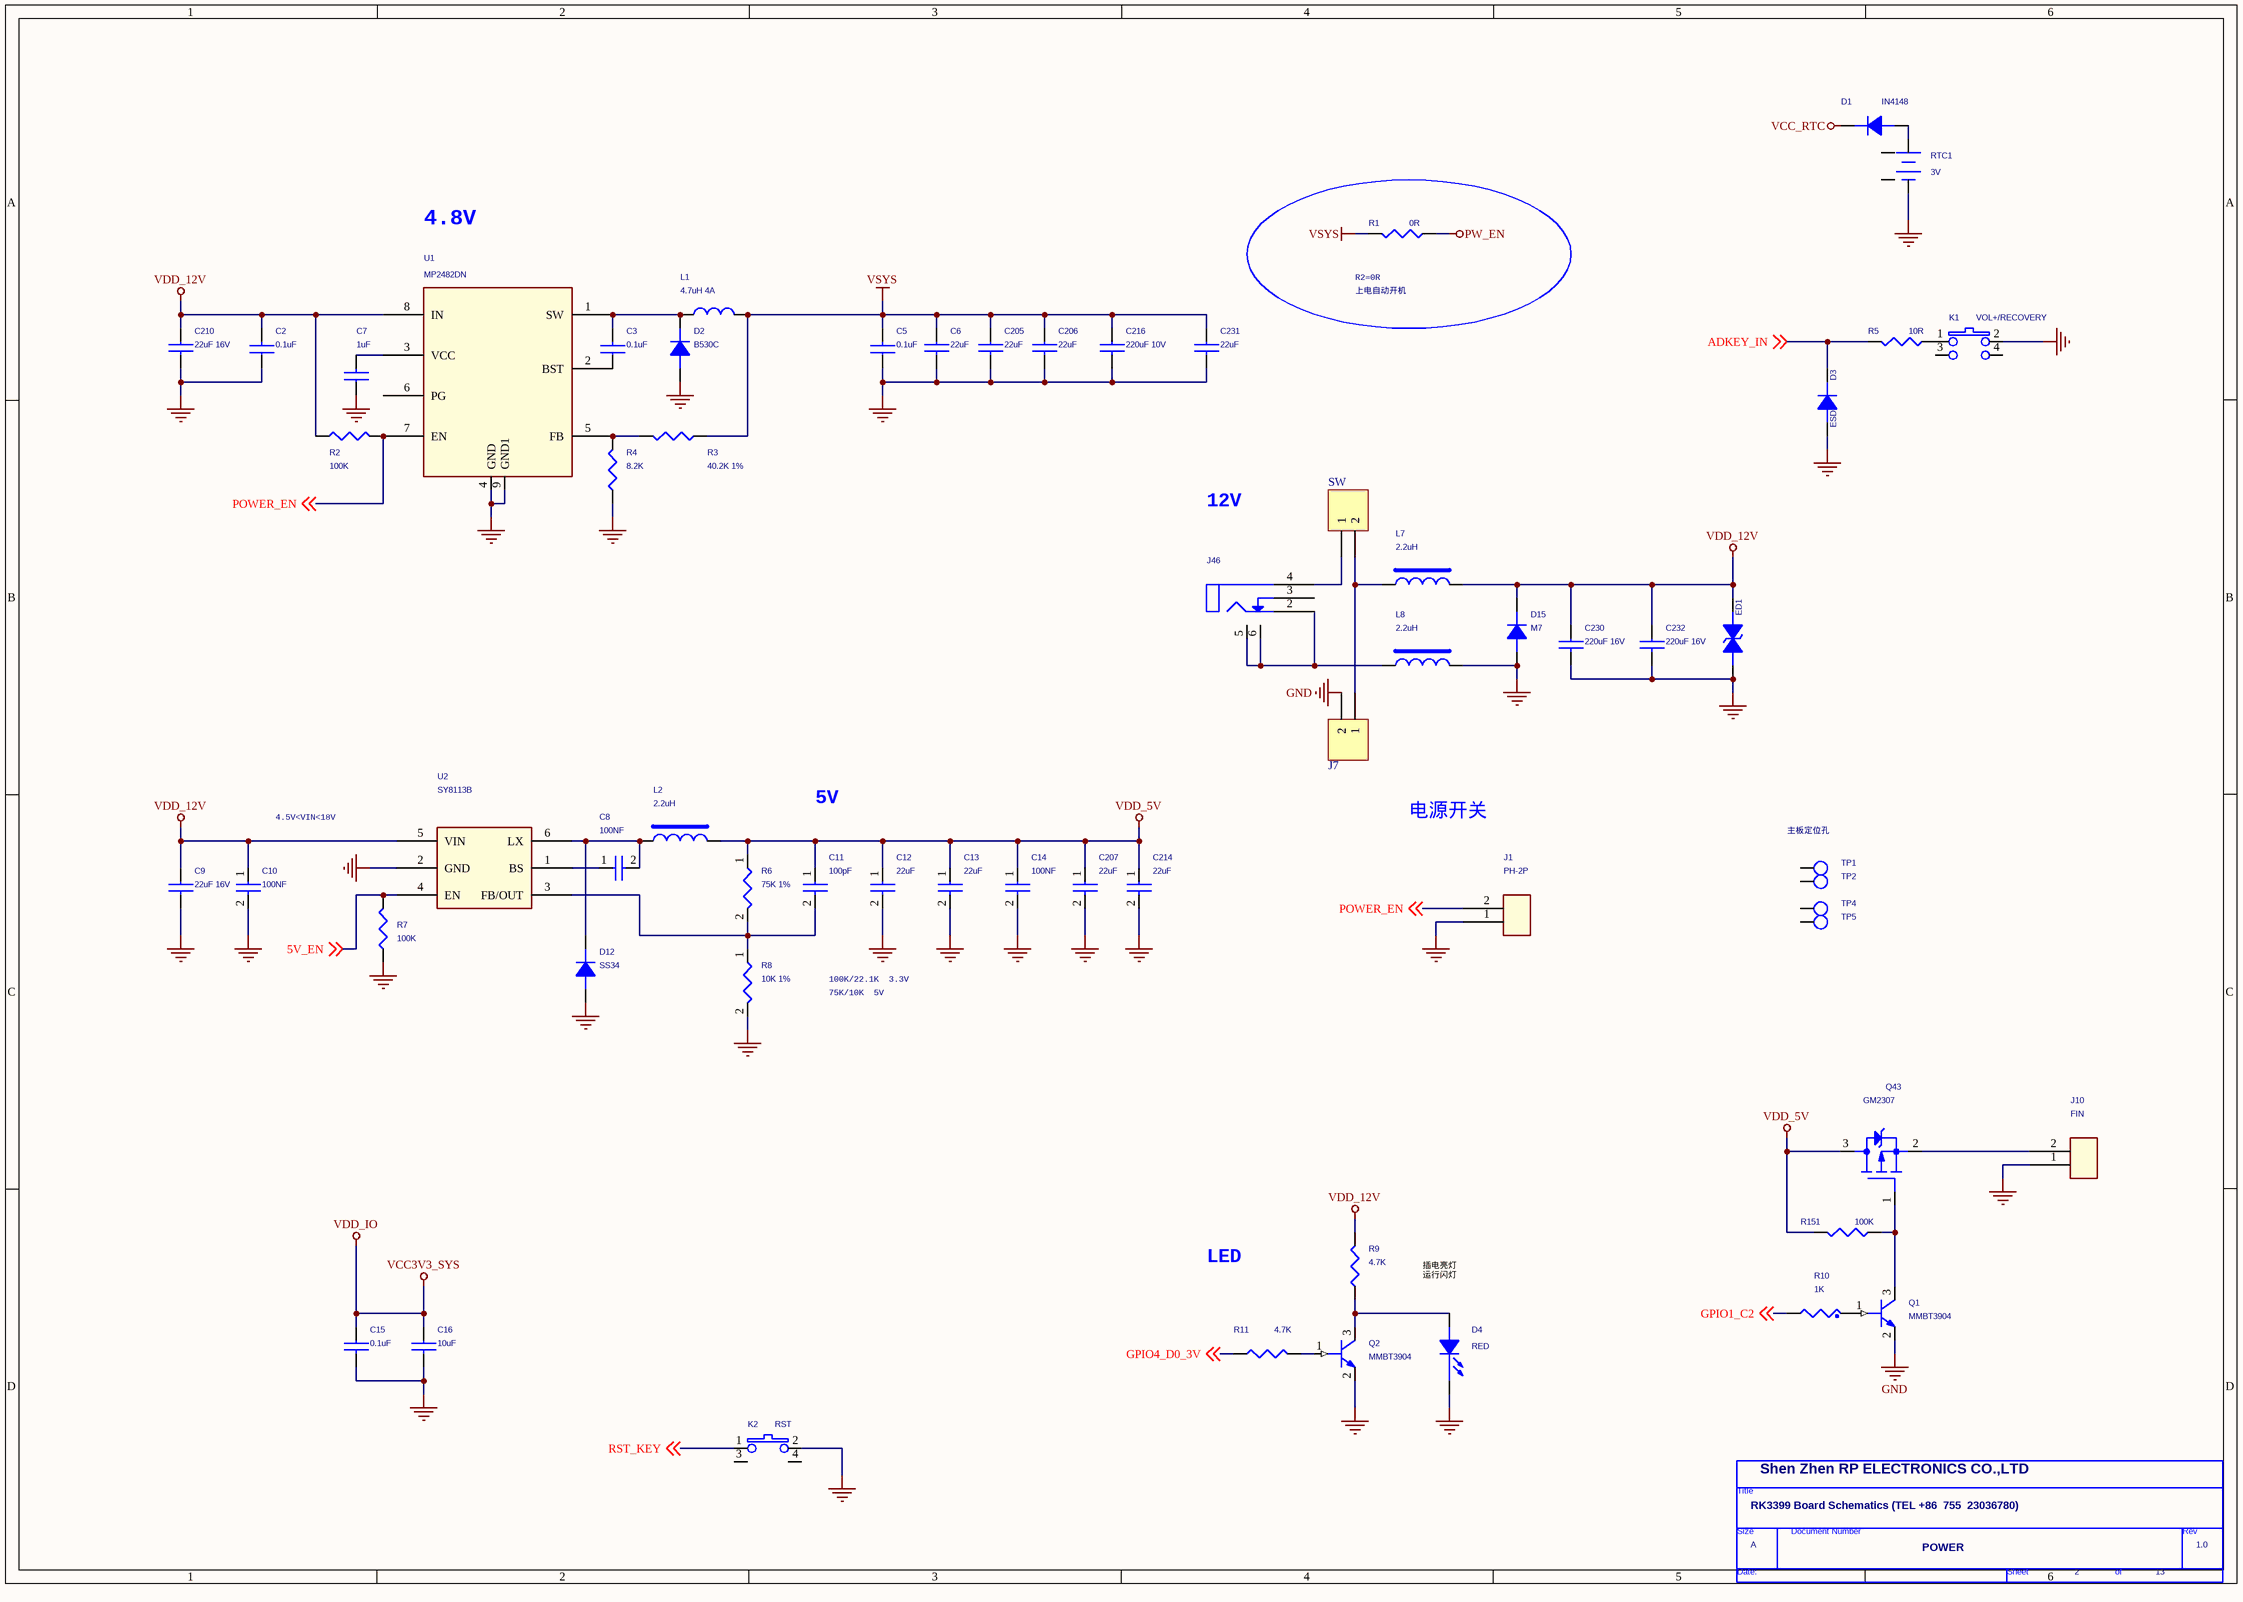
[diagram p6: 02.SchDoc]

### Parts
(Parts that share a designator on the sheet are numbered #1, #2 ... from top to bottom, then left to right.)
*#6  Doc: POWER  RevCode: 1.0  Title: RK3399 Board Schematics (TEL +86  755  23036780)  Page Size: A  Page Number: 2  Page Count: 13  Cage Code: Shen Zhen RP ELECTRONICS CO.,LTD  (hidden comment: TitleBlock0)  (graphical)
C2  0.1uF  [0805c]
C3  0.1uF  [0805C]
C5  0.1uF  [0805C]
C6  22uF  [0805C]
C7  1uF  [0805C]
C8  100NF  [0805C]
C9  22uF 16V  [3216C]
C10  100NF  [0805C]
C11  100pF  [0805C]
C12  22uF  [0805C]
C13  22uF  [0805C]
C14  100NF  [0805C]
C15  0.1uF  [0805C]
C16  10uF  [0805C]
C205  22uF  [0805C]
C206  22uF  [0805C]
C207  22uF  [0805C]
C210  22uF 16V  [3216c]
C214  22uF  [0805C]
C216  220uF 10V  [CASE-B]
C230  220uF 16V  [CAP-6X6]
C231  22uF  [0805C]
C232  220uF 16V  [CAP-6X6]
D1  IN4148  [SOD-323]
D2  B530C  [DO-214AB]
D3  ESD  [0805d]
D4  RED  [LED0805]
D12  SS34  [DO-214AC]
D15  M7  [DO-214AC]
ED1  ESD  [SOD-323]  (value not drawn)
J1  PH-2P  [SIP-2P-2D0]
J7  Header 2  [VH3.96*2]  (value not drawn)
J10  FIN  [SIP-2P-2D0]
J46  DC_5V  [DC044A]  (value not drawn)
K1  VOL+/RECOVERY  [KEYB]
K2  RST  [KEYB]
L1  4.7uH 4A  [VLS252012E]
L2  2.2uH  [l5d18]
L7  2.2uH  [l5d18]
L8  2.2uH  [l5d18]
Q1  MMBT3904  [SOT-23]
Q2  MMBT3904  [SOT-23]
Q43  GM2307  [SOT-23]
R1  0R  [0805]
R2  100K  [0805]
R3  40.2K 1%  [0805]
R4  8.2K  [0805]
R5  10R  [0805]
R6  75K 1%  [0805]
R7  100K  [0805]
R8  10K 1%  [0805]
R9  4.7K  [0805]
R10  1K  [0805]
R11  4.7K  [0805]
R151  100K  [0805]
RTC1  3V  [12505WR2]
SW  Header 2  [VH3.96*2]  (value not drawn)
TP1  T POINT R  [SCREW]  (value not drawn)
TP2  T POINT R  [SCREW]  (value not drawn)
TP4  T POINT R  [SCREW]  (value not drawn)
TP5  T POINT R  [SCREW]  (value not drawn)
U1  MP2482DN  [SO-8-A]
U2  SY8113B  [SOT23-6]

### Nets
GND: C2.1 C5.1 C6.2 C7.1 C9.2 C10.2 C12.2 C13.2 C14.2 C15.2 C16.2 C205.2 C206.2 C207.2 C210.2 C214.2 C216.2 C230.2 C231.2 C232.2 D2.1(A) D3.1(A) D4.2(CATHODE) D12.1(A) D15.1(A) ED1.2(K) J1.1 J7.2 J10.1 K1.2 K2.2 L8.2 Q1.2(EMITTER) Q2.2(EMITTER) R4.2 R7.1 R8.2 RTC1.2(-) U1.4(GND) U1.9(GND1) U2.2(GND)
PW_EN: R1.1
VCC3V3_SYS: C15.1 C16.1  [also labelled VDD_IO]
VCC_RTC: D1.2(K)
VDD_5V: C11.1 C12.1 C13.1 C14.1 C207.1 C214.1 L2.2 Q43.3(D) R6.1 R151.1  [project net HUB_5V]
VDD_12V: C2.2 C9.1 C10.1 C210.1 C230.1 C232.1 D15.2(K) ED1.1(A) L7.2 R2.1 R9.1 U1.8(IN) U2.5(VIN)
VSYS: C5.2 C6.1 C205.1 C206.1 C216.1 C231.1 L1.2 R1.2 R3.2  [project net VBAT_WL]
5V_EN: R7.2 U2.4(EN) ; off-sheet 5V_EN
ADKEY_IN: D3.2(K) R5.1 ; off-sheet ADKEY_IN
GPIO1_C2: R10.2 ; off-sheet GPIO1_C2
GPIO4_D0_3V: R11.1 ; off-sheet GPIO4_D0_3V
POWER_EN: J1.2 R2.2 U1.7(EN) ; off-sheet POWER_EN
RST_KEY: K2.1 ; off-sheet RST_KEY
NetC3_1: C3.1 U1.2(BST)
NetC3_2: C3.2 D2.2(K) L1.1 U1.1(SW)
NetC7_2: C7.2 U1.3(VCC)
NetC8_1: C8.1 U2.1(BS)
NetC8_2: C8.2 D12.2(K) L2.1 U2.6(LX)
NetC11_2: C11.2 R6.2 R8.1 U2.3(FB/OUT)
NetD1_1: D1.1(A) RTC1.1(+)
NetD4_1: D4.1(ANODE) Q2.3(COLLECT) R9.2
NetJ7_1: J7.1 L7.1 SW.2
NetJ10_2: J10.2 Q43.2(S)
NetJ46_2: J46.2 J46.5 J46.6 L8.1
NetJ46_4: J46.4 SW.1
NetK1_1: K1.1 R5.2
NetQ1_1: Q1.1(BASE) R10.1
NetQ1_3: Q1.3(COLLECT) Q43.1(G) R151.2
NetQ2_1: Q2.1(BASE) R11.2
NetR3_1: R3.1 R4.1 U1.5(FB)

Not connected (* = marked no-connect by the designer): J46 3; K1 3 4; K2 3 4; RTC1 3 4; TP1 1(TP); TP2 1(TP); TP4 1(TP); TP5 1(TP); U1 6(PG)

### Notes on the sheet
- 4.8V
- (near R1) R2=0R
- 上电自动开机
- 12V
- 4.5V<VIN<18V
- 5V
- 电源开关
- 主板定位孔
- 100K/22.1K  3.3V
- 75K/10K  5V
- LED
- 插电亮灯
  运行闪灯
- (in symbol TitleBlock0) Title; Size; Document Number; Rev; Date:; Sheet; of

### Library data of the parts
C2 C3 C5 C7 = C1005_0
C6 C16 C205 C206 C231 = CAP NP_3: CAP,MLCC,100nF,+/-10%,X7R,6.3V,SMD0402
C8 = CAP NP_Dup2: as C170 on sheet 07; Voltage: 25V; Dielectric: X5R; Created by: JJJ; Part Type: C0402; RK PN: C1005X5R1E104K050BC
C9 C210 C216 C230 C232 = CAP NP_Dup8
C10 = CAP NP_Dup2: as C168 on sheet 07; Voltage: 25V; Dielectric: X5R; Part Type: C0402; Manufacturer PN: C1005X5R1E104K050BC; Created by: JJJ
C11 = CAP NP_Dup2: cap,100.00pF,+/-5%,50V,C0G,C0402; Manufacturer: TDK; RK PN: C1005C0G1H101J050BA; Priority: A; Tolerance: 5%; Voltage: 50V; Dielectric: C0G; Part Type: C0402; Manufacturer PN: C1005C0G1H101J050BA; Created by: JJJ
C12 C207 C214 = CAP NP_Dup2: cap,22.00uF,+/-10%,10V,X5R,C0805; Manufacturer: TDK; RK PN: C2012X5R1A226K125AB; Priority: A; Tolerance: 10%; Voltage: 10V; Dielectric: X5R; Part Type: C0805; Manufacturer PN: C2012X5R1A226K125AB; Created by: JJJ
C13 = CAP NP_Dup2: as C200 on sheet 13; Voltage: 10V; Dielectric: X5R; Part Type: C0805; Manufacturer PN: C2012X5R1A106K125AB; Created by: JJJ
C14 = CAP NP_Dup2: cap,100.00nF,+/-10%,16V,X5R,C0402; Manufacturer: TDK; RK PN: C1005X5R1C104K050BA; Priority: A; Tolerance: 10%; Voltage: 16V; Dielectric: X5R; Part Type: C0402; Manufacturer PN: C1005X5R1C104K050BA; Created by: JJJ
C15 = 02CAPP
D1 D3 = DIODE_Dup2
D2 D12 D15 = DIODE_Dup1
D4 = LED
ED1 = DIODE BI-DIR TRIG
J1 = CON2
J7 SW = Header 2: Header, 2-Pin; LatestRevisionDate: 17-Jul-2002; LatestRevisionNote: Re-released for DXP Platform.; Publisher: Altium Limited
J10 = CON4_0_Dup1
J46 = CONN JACK PWR_0_Dup1
K1 = KEYB_0
K2 = KEYB_1
L1 = VLS252012E_0
L2 L7 = INDUCTORS OF FERRITE: Power Inductor,3.3uH,0.2,IND_404030; Manufacturer: sunlord; DC Resistor: 0.04ohm; Isat: 3.3A; RK PN: SWPA4030S3R3MT; Priority: A; Tolerance: 20%; Irms: 2.4A; Resonace frequency: 38M; Part Type: POWER_IND; Manufacturer PN: SWPA4030S3R3MT; Created by: YTL
L8 = INDUCTORS OF FERRITE: as L5 on sheet 07; Created by: YTL; Part Type: POWER_IND; RK PN: SWPA4030S3R3MT
Q1 Q2 = NPN_1
Q43 = APM2301
R1 R7 R11 = R_Dup1
R2 = RESISTOR_5: 通用厚膜电阻,10K,+/-5%,R0402,1/16W.; Manufacturer PN: RC0402JR-0710KL; Manufacturer: YAGEO; Tolerance: 5%; Wattage: 1/16W; Priority: A; Created by: YTL; Part Type: 通用厚膜电阻; RK PN: RC0402JR-0710KL
R3 R4 R9 R151 = R1005_0_Dup1
R5 = RES 1B: ROHS CHIP RES 4.7Ohm 1/8W +/-5%
R6 = RESISTOR_Dup1: as R127 on sheet 07; Tolerance: 1%; Part Type: 通用厚膜电阻; Manufacturer PN: RC0402FR-0775KL; Created by: YTL
R8 = RESISTOR_Dup1: as R129 on sheet 07; Tolerance: 1%; Created by: YTL; Part Type: 通用厚膜电阻; RK PN: RC0402FR-0710KL
R10 = RES: RES MF 10.0K 1/16W 1% 0402; CLASS: DISCRETE; SIGNAL_MODEL: DEFAULT_RESISTOR_10000OHM_2_1; FPLIST: RC0402_25,RC0402_HD,0402_CC; CAD_APPROVED: Yes; MFG_PN01: CRCW040210K0FKED; MFG_NAME01: VISHAY INTERTECHNOLOGY; AGILE_PN: 470-75416; ROHS: Yes; Tolerance: 1%
RTC1 = BATTERY_5
U1 = MP2482DN_1
U2 = DCDC_SY8113: Manufacturer: Silergy（矽力杰）; Priority: A; RK PN: SY8113B; Part Type: DCDC; Manufacturer PN: SY8113B; Created by: JJJ
*#6 = TitleBlock0: Page Create Date: March  8, 1995

## Sheet 01.SchDoc
size 420 x 297 mm
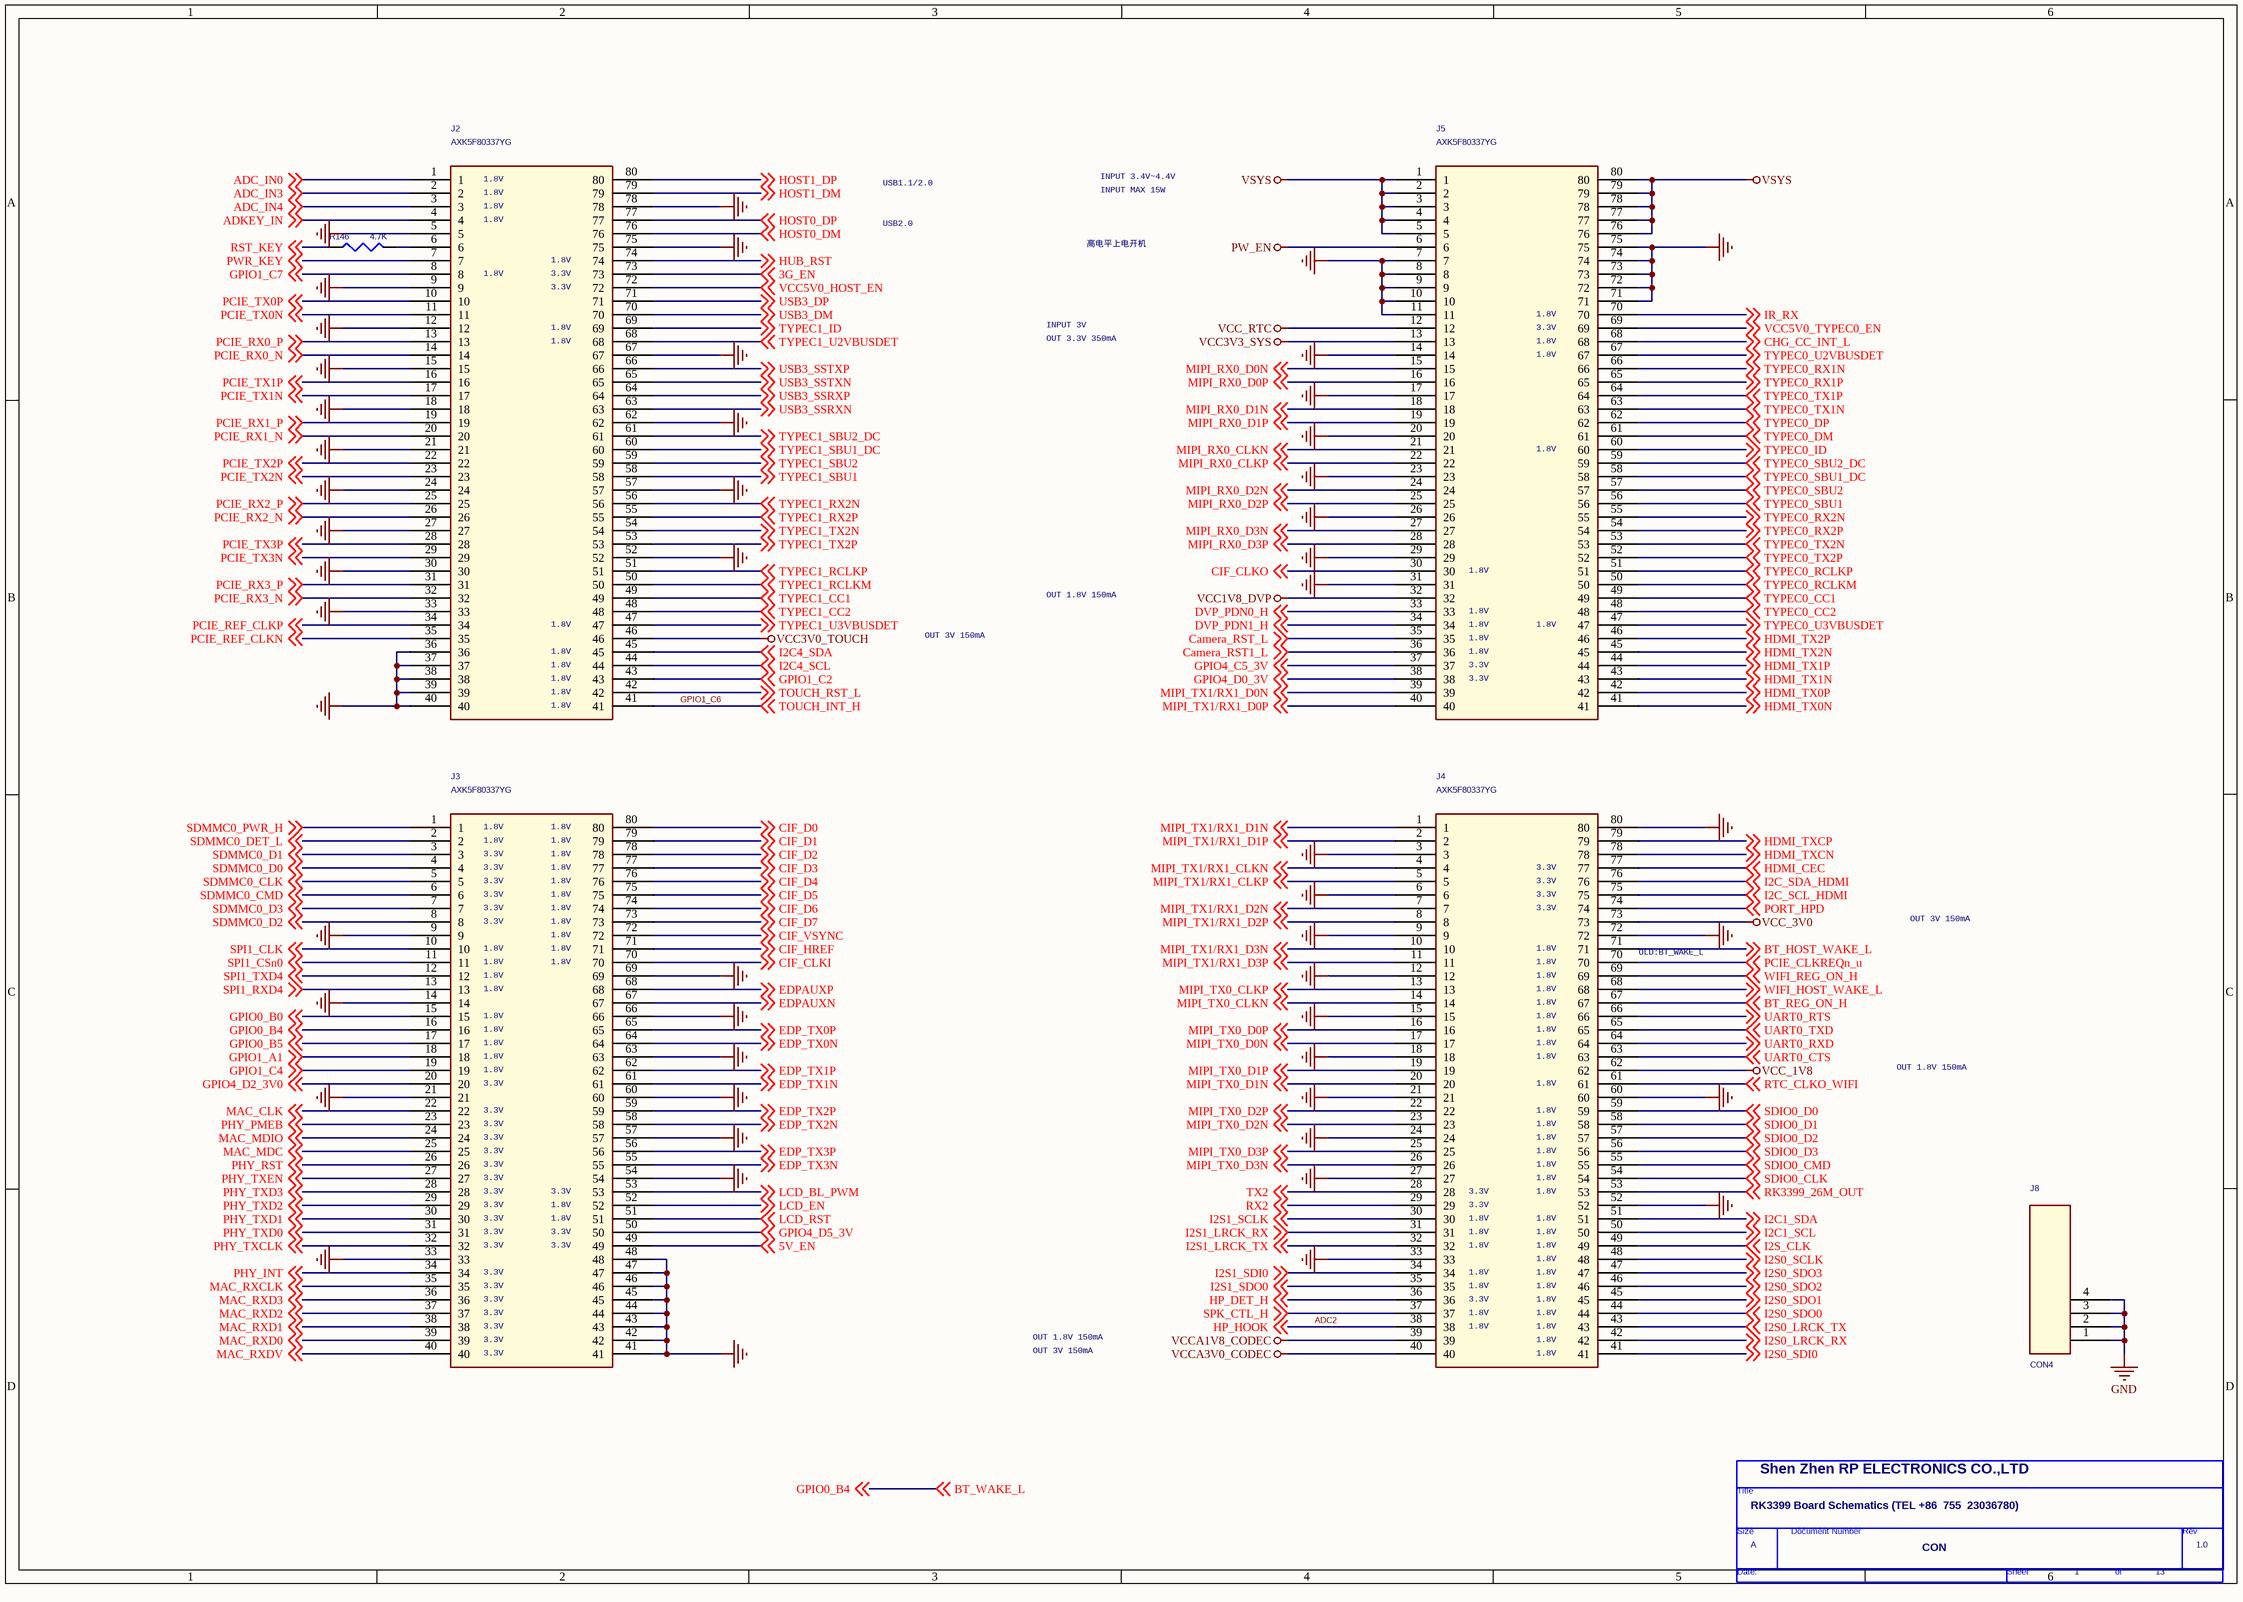
[diagram p7: 01.SchDoc]

### Parts
(Parts that share a designator on the sheet are numbered #1, #2 ... from top to bottom, then left to right.)
*#7  Doc: CON  RevCode: 1.0  Title: RK3399 Board Schematics (TEL +86  755  23036780)  Page Size: A  Page Number: 1  Page Count: 13  Cage Code: Shen Zhen RP ELECTRONICS CO.,LTD  (hidden comment: TitleBlock0)  (graphical)
J2  AXK5F80337YG  [AXK5F80337YG]
J3  AXK5F80337YG  [AXK5F80337YG]
J4  AXK5F80337YG  [AXK5F80337YG]
J5  AXK5F80337YG  [AXK5F80337YG]
J8  CON4  [DIP-CORE]
R146  4.7K  [0805]

### Nets
GND: J2.5 J2.9 J2.12 J2.15 J2.18 J2.21 J2.24 J2.27 J2.30 J2.33 J2.36 J2.37 J2.38 J2.39 J2.40 J2.52 J2.57 J2.62 J2.67 J2.75 J2.78 J3.9 J3.14 J3.21 J3.33 J3.41 J3.42 J3.43 J3.44 J3.45 J3.46 J3.47 J3.48 J3.54 J3.57 J3.60 J3.63 J3.66 J3.69 J4.3 J4.6 J4.9 J4.12 J4.15 J4.18 J4.21 J4.24 J4.27 J4.33 J4.52 J4.60 J4.72 J4.80 J5.7 J5.8 J5.9 J5.10 J5.11 J5.14 J5.17 J5.20 J5.23 J5.26 J5.29 J5.31 J5.71 J5.72 J5.73 J5.74 J5.75 J8.1 J8.2 J8.3 J8.4
PW_EN: J5.6
VCC1V8_DVP: J5.32
VCC3V0_TOUCH: J2.46
VCC3V3_SYS: J5.13
VCC_1V8: J4.62
VCC_3V0: J4.73
VCC_RTC: J5.12
VCCA1V8_CODEC: J4.39
VCCA3V0_CODEC: J4.40
VSYS: J5.1 J5.2 J5.3 J5.4 J5.5 J5.76 J5.77 J5.78 J5.79 J5.80  [project net VBAT_WL]
3G_EN: J2.73 ; off-sheet 3G_EN
5V_EN: J3.49 ; off-sheet 5V_EN
ADC2: J4.38 ; off-sheet HP_HOOK  [also labelled HP_HOOK]
ADC_IN0: J2.1 ; off-sheet ADC_IN0
ADC_IN3: J2.2 ; off-sheet ADC_IN3
ADC_IN4: J2.3 ; off-sheet ADC_IN4
ADKEY_IN: J2.4 ; off-sheet ADKEY_IN
BT_HOST_WAKE_L: J4.71 ; off-sheet BT_HOST_WAKE_L  [project net BT_HOST_WAKE]
BT_REG_ON_H: J4.67 ; off-sheet BT_REG_ON_H  [project net BT_RST]
BT_WAKE_L: J3.16 ; off-sheet GPIO0_B4, off-sheet BT_WAKE_L  [also labelled GPIO0_B4]  [project net BT_WAKE]
Camera_RST1_L: J5.36 ; off-sheet Camera_RST1_L
Camera_RST_L: J5.35 ; off-sheet Camera_RST_L
CHG_CC_INT_L: J5.68 ; off-sheet CHG_CC_INT_L
CIF_CLKI: J3.70 ; off-sheet CIF_CLKI
CIF_CLKO: J5.30 ; off-sheet CIF_CLKO
CIF_D0: J3.80 ; off-sheet CIF_D0
CIF_D1: J3.79 ; off-sheet CIF_D1
CIF_D2: J3.78 ; off-sheet CIF_D2
CIF_D3: J3.77 ; off-sheet CIF_D3
CIF_D4: J3.76 ; off-sheet CIF_D4
CIF_D5: J3.75 ; off-sheet CIF_D5
CIF_D6: J3.74 ; off-sheet CIF_D6
CIF_D7: J3.73 ; off-sheet CIF_D7
CIF_HREF: J3.71 ; off-sheet CIF_HREF
CIF_VSYNC: J3.72 ; off-sheet CIF_VSYNC
DVP_PDN0_H: J5.33 ; off-sheet DVP_PDN0_H
DVP_PDN1_H: J5.34 ; off-sheet DVP_PDN1_H
EDP_TX0N: J3.64 ; off-sheet EDP_TX0N
EDP_TX0P: J3.65 ; off-sheet EDP_TX0P
EDP_TX1N: J3.61 ; off-sheet EDP_TX1N
EDP_TX1P: J3.62 ; off-sheet EDP_TX1P
EDP_TX2N: J3.58 ; off-sheet EDP_TX2N
EDP_TX2P: J3.59 ; off-sheet EDP_TX2P
EDP_TX3N: J3.55 ; off-sheet EDP_TX3N
EDP_TX3P: J3.56 ; off-sheet EDP_TX3P
EDPAUXN: J3.67 ; off-sheet EDPAUXN
EDPAUXP: J3.68 ; off-sheet EDPAUXP
GPIO0_B0: J3.15 ; off-sheet GPIO0_B0
GPIO0_B5: J3.17 ; off-sheet GPIO0_B5
GPIO1_A1: J3.18 ; off-sheet GPIO1_A1
GPIO1_C2: J2.43 ; off-sheet GPIO1_C2
GPIO1_C4: J3.19 ; off-sheet GPIO1_C4
GPIO1_C6: J2.41 ; off-sheet TOUCH_INT_H  [also labelled TOUCH_INT_H]
GPIO1_C7: J2.8 ; off-sheet GPIO1_C7
GPIO4_C5_3V: J5.37 ; off-sheet GPIO4_C5_3V
GPIO4_D0_3V: J5.38 ; off-sheet GPIO4_D0_3V
GPIO4_D2_3V0: J3.20 ; off-sheet GPIO4_D2_3V0
GPIO4_D5_3V: J3.50 ; off-sheet GPIO4_D5_3V
HDMI_CEC: J4.77 ; off-sheet HDMI_CEC
HDMI_TX0N: J5.41 ; off-sheet HDMI_TX0N
HDMI_TX0P: J5.42 ; off-sheet HDMI_TX0P
HDMI_TX1N: J5.43 ; off-sheet HDMI_TX1N
HDMI_TX1P: J5.44 ; off-sheet HDMI_TX1P
HDMI_TX2N: J5.45 ; off-sheet HDMI_TX2N
HDMI_TX2P: J5.46 ; off-sheet HDMI_TX2P
HDMI_TXCN: J4.78 ; off-sheet HDMI_TXCN
HDMI_TXCP: J4.79 ; off-sheet HDMI_TXCP
HOST0_DM: J2.76 ; off-sheet HOST0_DM
HOST0_DP: J2.77 ; off-sheet HOST0_DP
HOST1_DM: J2.79 ; off-sheet HOST1_DM
HOST1_DP: J2.80 ; off-sheet HOST1_DP
HP_DET_H: J4.36 ; off-sheet HP_DET_H
HUB_RST: J2.74 ; off-sheet HUB_RST
I2C1_SCL: J4.50 ; off-sheet I2C1_SCL
I2C1_SDA: J4.51 ; off-sheet I2C1_SDA
I2C4_SCL: J2.44 ; off-sheet I2C4_SCL
I2C4_SDA: J2.45 ; off-sheet I2C4_SDA
I2C_SCL_HDMI: J4.75 ; off-sheet I2C_SCL_HDMI
I2C_SDA_HDMI: J4.76 ; off-sheet I2C_SDA_HDMI
I2S0_LRCK_RX: J4.42 J4.43 ; off-sheet I2S0_LRCK_TX, off-sheet I2S0_LRCK_RX  [also labelled I2S0_LRCK_TX]
I2S0_SCLK: J4.48 ; off-sheet I2S0_SCLK
I2S0_SDI0: J4.41 ; off-sheet I2S0_SDI0
I2S0_SDO0: J4.44 ; off-sheet I2S0_SDO0
I2S0_SDO1: J4.45 ; off-sheet I2S0_SDO1
I2S0_SDO2: J4.46 ; off-sheet I2S0_SDO2
I2S0_SDO3: J4.47 ; off-sheet I2S0_SDO3
I2S1_LRCK_RX: J4.31 ; off-sheet I2S1_LRCK_RX
I2S1_LRCK_TX: J4.32 ; off-sheet I2S1_LRCK_TX
I2S1_SCLK: J4.30 ; off-sheet I2S1_SCLK
I2S1_SDI0: J4.34 ; off-sheet I2S1_SDI0
I2S1_SDO0: J4.35 ; off-sheet I2S1_SDO0
I2S_CLK: J4.49 ; off-sheet I2S_CLK
IR_RX: J5.70 ; off-sheet IR_RX
LCD_BL_PWM: J3.53 ; off-sheet LCD_BL_PWM
LCD_EN: J3.52 ; off-sheet LCD_EN
LCD_RST: J3.51 ; off-sheet LCD_RST
MAC_CLK: J3.22 ; off-sheet MAC_CLK
MAC_MDC: J3.25 ; off-sheet MAC_MDC
MAC_MDIO: J3.24 ; off-sheet MAC_MDIO
MAC_RXCLK: J3.35 ; off-sheet MAC_RXCLK
MAC_RXD0: J3.39 ; off-sheet MAC_RXD0
MAC_RXD1: J3.38 ; off-sheet MAC_RXD1
MAC_RXD2: J3.37 ; off-sheet MAC_RXD2
MAC_RXD3: J3.36 ; off-sheet MAC_RXD3
MAC_RXDV: J3.40 ; off-sheet MAC_RXDV
MIPI_RX0_CLKN: J5.21 ; off-sheet MIPI_RX0_CLKN
MIPI_RX0_CLKP: J5.22 ; off-sheet MIPI_RX0_CLKP
MIPI_RX0_D0N: J5.15 ; off-sheet MIPI_RX0_D0N
MIPI_RX0_D0P: J5.16 ; off-sheet MIPI_RX0_D0P
MIPI_RX0_D1N: J5.18 ; off-sheet MIPI_RX0_D1N
MIPI_RX0_D1P: J5.19 ; off-sheet MIPI_RX0_D1P
MIPI_RX0_D2N: J5.24 ; off-sheet MIPI_RX0_D2N
MIPI_RX0_D2P: J5.25 ; off-sheet MIPI_RX0_D2P
MIPI_RX0_D3N: J5.27 ; off-sheet MIPI_RX0_D3N
MIPI_RX0_D3P: J5.28 ; off-sheet MIPI_RX0_D3P
MIPI_TX0_CLKN: J4.14 ; off-sheet MIPI_TX0_CLKN
MIPI_TX0_CLKP: J4.13 ; off-sheet MIPI_TX0_CLKP
MIPI_TX0_D0N: J4.17 ; off-sheet MIPI_TX0_D0N
MIPI_TX0_D0P: J4.16 ; off-sheet MIPI_TX0_D0P
MIPI_TX0_D1N: J4.20 ; off-sheet MIPI_TX0_D1N
MIPI_TX0_D1P: J4.19 ; off-sheet MIPI_TX0_D1P
MIPI_TX0_D2N: J4.23 ; off-sheet MIPI_TX0_D2N
MIPI_TX0_D2P: J4.22 ; off-sheet MIPI_TX0_D2P
MIPI_TX0_D3N: J4.26 ; off-sheet MIPI_TX0_D3N
MIPI_TX0_D3P: J4.25 ; off-sheet MIPI_TX0_D3P
MIPI_TX1/RX1_CLKN: J4.4 ; off-sheet MIPI_TX1/RX1_CLKN
MIPI_TX1/RX1_CLKP: J4.5 ; off-sheet MIPI_TX1/RX1_CLKP
MIPI_TX1/RX1_D0N: J5.39 ; off-sheet MIPI_TX1/RX1_D0N
MIPI_TX1/RX1_D0P: J5.40 ; off-sheet MIPI_TX1/RX1_D0P
MIPI_TX1/RX1_D1N: J4.1 ; off-sheet MIPI_TX1/RX1_D1N
MIPI_TX1/RX1_D1P: J4.2 ; off-sheet MIPI_TX1/RX1_D1P
MIPI_TX1/RX1_D2N: J4.7 ; off-sheet MIPI_TX1/RX1_D2N
MIPI_TX1/RX1_D2P: J4.8 ; off-sheet MIPI_TX1/RX1_D2P
MIPI_TX1/RX1_D3N: J4.10 ; off-sheet MIPI_TX1/RX1_D3N
MIPI_TX1/RX1_D3P: J4.11 ; off-sheet MIPI_TX1/RX1_D3P
PCIE_CLKREQn_u: J4.70 ; off-sheet PCIE_CLKREQn_u
PCIE_REF_CLKN: J2.35 ; off-sheet PCIE_REF_CLKN
PCIE_REF_CLKP: J2.34 ; off-sheet PCIE_REF_CLKP
PCIE_RX0_N: J2.14 ; off-sheet PCIE_RX0_N
PCIE_RX0_P: J2.13 ; off-sheet PCIE_RX0_P
PCIE_RX1_N: J2.20 ; off-sheet PCIE_RX1_N
PCIE_RX1_P: J2.19 ; off-sheet PCIE_RX1_P
PCIE_RX2_N: J2.26 ; off-sheet PCIE_RX2_N
PCIE_RX2_P: J2.25 ; off-sheet PCIE_RX2_P
PCIE_RX3_N: J2.32 ; off-sheet PCIE_RX3_N
PCIE_RX3_P: J2.31 ; off-sheet PCIE_RX3_P
PCIE_TX0N: J2.11 ; off-sheet PCIE_TX0N
PCIE_TX0P: J2.10 ; off-sheet PCIE_TX0P
PCIE_TX1N: J2.17 ; off-sheet PCIE_TX1N
PCIE_TX1P: J2.16 ; off-sheet PCIE_TX1P
PCIE_TX2N: J2.23 ; off-sheet PCIE_TX2N
PCIE_TX2P: J2.22 ; off-sheet PCIE_TX2P
PCIE_TX3N: J2.29 ; off-sheet PCIE_TX3N
PCIE_TX3P: J2.28 ; off-sheet PCIE_TX3P
PHY_INT: J3.34 ; off-sheet PHY_INT
PHY_PMEB: J3.23 ; off-sheet PHY_PMEB
PHY_RST: J3.26 ; off-sheet PHY_RST
PHY_TXCLK: J3.32 ; off-sheet PHY_TXCLK
PHY_TXD0: J3.31 ; off-sheet PHY_TXD0
PHY_TXD1: J3.30 ; off-sheet PHY_TXD1
PHY_TXD2: J3.29 ; off-sheet PHY_TXD2
PHY_TXD3: J3.28 ; off-sheet PHY_TXD3
PHY_TXEN: J3.27 ; off-sheet PHY_TXEN
PORT_HPD: J4.74 ; off-sheet PORT_HPD
PWR_KEY: J2.7 ; off-sheet PWR_KEY
RK3399_26M_OUT: J4.53 ; off-sheet RK3399_26M_OUT
RST_KEY: R146.1 ; off-sheet RST_KEY
RTC_CLKO_WIFI: J4.61 ; off-sheet RTC_CLKO_WIFI  [project net WIFIBT_32KIN]
RX2: J4.29 ; off-sheet RX2
SDIO0_CLK: J4.54 ; off-sheet SDIO0_CLK  [project net WIFI_CLK]
SDIO0_CMD: J4.55 ; off-sheet SDIO0_CMD  [project net WIFI_CMD]
SDIO0_D0: J4.59 ; off-sheet SDIO0_D0  [project net WIFI_D0]
SDIO0_D1: J4.58 ; off-sheet SDIO0_D1  [project net WIFI_D1]
SDIO0_D2: J4.57 ; off-sheet SDIO0_D2  [project net WIFI_D2]
SDIO0_D3: J4.56 ; off-sheet SDIO0_D3  [project net WIFI_D3]
SDMMC0_CLK: J3.5 ; off-sheet SDMMC0_CLK
SDMMC0_CMD: J3.6 ; off-sheet SDMMC0_CMD
SDMMC0_D0: J3.4 ; off-sheet SDMMC0_D0
SDMMC0_D1: J3.3 ; off-sheet SDMMC0_D1
SDMMC0_D2: J3.8 ; off-sheet SDMMC0_D2
SDMMC0_D3: J3.7 ; off-sheet SDMMC0_D3
SDMMC0_DET_L: J3.2 ; off-sheet SDMMC0_DET_L
SDMMC0_PWR_H: J3.1 ; off-sheet SDMMC0_PWR_H
SPI1_CLK: J3.10 ; off-sheet SPI1_CLK
SPI1_CSn0: J3.11 ; off-sheet SPI1_CSn0
SPI1_RXD4: J3.13 ; off-sheet SPI1_RXD4
SPI1_TXD4: J3.12 ; off-sheet SPI1_TXD4
SPK_CTL_H: J4.37 ; off-sheet SPK_CTL_H
TOUCH_RST_L: J2.42 ; off-sheet TOUCH_RST_L
TX2: J4.28 ; off-sheet TX2
TYPEC0_CC1: J5.49 ; off-sheet TYPEC0_CC1
TYPEC0_CC2: J5.48 ; off-sheet TYPEC0_CC2
TYPEC0_DM: J5.61 ; off-sheet TYPEC0_DM
TYPEC0_DP: J5.62 ; off-sheet TYPEC0_DP
TYPEC0_ID: J5.60 ; off-sheet TYPEC0_ID
TYPEC0_RCLKM: J5.50 ; off-sheet TYPEC0_RCLKM
TYPEC0_RCLKP: J5.51 ; off-sheet TYPEC0_RCLKP
TYPEC0_RX1N: J5.66 ; off-sheet TYPEC0_RX1N
TYPEC0_RX1P: J5.65 ; off-sheet TYPEC0_RX1P
TYPEC0_RX2N: J5.55 ; off-sheet TYPEC0_RX2N
TYPEC0_RX2P: J5.54 ; off-sheet TYPEC0_RX2P
TYPEC0_SBU1: J5.56 ; off-sheet TYPEC0_SBU1
TYPEC0_SBU1_DC: J5.58 ; off-sheet TYPEC0_SBU1_DC
TYPEC0_SBU2: J5.57 ; off-sheet TYPEC0_SBU2
TYPEC0_SBU2_DC: J5.59 ; off-sheet TYPEC0_SBU2_DC
TYPEC0_TX1N: J5.63 ; off-sheet TYPEC0_TX1N
TYPEC0_TX1P: J5.64 ; off-sheet TYPEC0_TX1P
TYPEC0_TX2N: J5.53 ; off-sheet TYPEC0_TX2N
TYPEC0_TX2P: J5.52 ; off-sheet TYPEC0_TX2P
TYPEC0_U2VBUSDET: J5.67 ; off-sheet TYPEC0_U2VBUSDET
TYPEC0_U3VBUSDET: J5.47 ; off-sheet TYPEC0_U3VBUSDET
TYPEC1_CC1: J2.49 ; off-sheet TYPEC1_CC1
TYPEC1_CC2: J2.48 ; off-sheet TYPEC1_CC2
TYPEC1_ID: J2.69 ; off-sheet TYPEC1_ID
TYPEC1_RCLKM: J2.50 ; off-sheet TYPEC1_RCLKM
TYPEC1_RCLKP: J2.51 ; off-sheet TYPEC1_RCLKP
TYPEC1_RX2N: J2.56 ; off-sheet TYPEC1_RX2N
TYPEC1_RX2P: J2.55 ; off-sheet TYPEC1_RX2P
TYPEC1_SBU1: J2.58 ; off-sheet TYPEC1_SBU1
TYPEC1_SBU1_DC: J2.60 ; off-sheet TYPEC1_SBU1_DC
TYPEC1_SBU2: J2.59 ; off-sheet TYPEC1_SBU2
TYPEC1_SBU2_DC: J2.61 ; off-sheet TYPEC1_SBU2_DC
TYPEC1_TX2N: J2.54 ; off-sheet TYPEC1_TX2N
TYPEC1_TX2P: J2.53 ; off-sheet TYPEC1_TX2P
TYPEC1_U2VBUSDET: J2.68 ; off-sheet TYPEC1_U2VBUSDET
TYPEC1_U3VBUSDET: J2.47 ; off-sheet TYPEC1_U3VBUSDET
UART0_CTS: J4.63 ; off-sheet UART0_CTS
UART0_RTS: J4.66 ; off-sheet UART0_RTS
UART0_RXD: J4.64 ; off-sheet UART0_RXD
UART0_TXD: J4.65 ; off-sheet UART0_TXD
USB3_DM: J2.70 ; off-sheet USB3_DM
USB3_DP: J2.71 ; off-sheet USB3_DP
USB3_SSRXN: J2.63 ; off-sheet USB3_SSRXN
USB3_SSRXP: J2.64 ; off-sheet USB3_SSRXP
USB3_SSTXN: J2.65 ; off-sheet USB3_SSTXN
USB3_SSTXP: J2.66 ; off-sheet USB3_SSTXP
VCC5V0_HOST_EN: J2.72 ; off-sheet VCC5V0_HOST_EN
VCC5V0_TYPEC0_EN: J5.69 ; off-sheet VCC5V0_TYPEC0_EN
WIFI_HOST_WAKE_L: J4.68 ; off-sheet WIFI_HOST_WAKE_L  [project net WIFI_HOST_WAKE]
WIFI_REG_ON_H: J4.69 ; off-sheet WIFI_REG_ON_H  [project net WIFI_REG_ON]
NetJ2_6: J2.6 R146.2

### Notes on the sheet
- (near J2) 1.8V
- USB1.1/2.0
- INPUT MAX 15W
- INPUT 3.4V~4.4V
- USB2.0
- 高电平上电开机
- (near J2) 3.3V
- INPUT 3V
- (near J5) 1.8V
- (near J5) 3.3V
- OUT 3.3V 350mA
- OUT 1.8V 150mA
- OUT 3V 150mA
- (near J3) 1.8V
- (near J3) 3.3V
- (near J4) 3.3V
- (near J4) 1.8V
- (near J4) OLD:BT_WAKE_L
- (in symbol TitleBlock0) Title; Size; Document Number; Rev; Date:; Sheet; of

### Library data of the parts
J2-J5 = CON40_0
J8 = CON10_0
R146 = R_Dup1
*#7 = TitleBlock0: Page Create Date: March  8, 1995

## Nets that join several sheets
GND: 13 (19 pins), 09 (30 pins), 07 (18 pins), 04 (18 pins), 03 (33 pins), 02 (41 pins), 01 (74 pins)
HUB_5V: 07 (J27.1), 03 (17 pins), 02 (10 pins)
PW_EN: 02 (R1.1), 01 (J5.6)
VBAT_WL: 09 (C159.1 C160.2 U19.9), 07 (C134.1 U17.1), 02 (9 pins), 01 (10 pins)
VCC3V0_TOUCH: 07 (J27.9), 01 (J2.46)
VCC3V3_SYS: 02 (C15.1 C16.1), 01 (J5.13)
VCC_1V8: 09 (13 pins), 01 (J4.62)
VCC_RTC: 02 (D1.2), 01 (J5.12)
VCCA1V8_CODEC: 13 (C198.1 Q10.1 R144.1 U22.6), 04 (6 pins), 01 (J4.39)
VCCA3V0_CODEC: 04 (6 pins), 01 (J4.40)
VDD_3G: 13 (12 pins), 07 (7 pins)
VDD_12V: 07 (C169.1 C170.1 U20.5), 02 (13 pins)
3G_EN: 07 (R128.1 U20.4), 01 (J2.73)
5V_EN: 02 (R7.2 U2.4), 01 (J3.49)
ADKEY_IN: 02 (D3.2 R5.1), 01 (J2.4)
BT_HOST_WAKE: 09 (R124.2 U19.7), 01 (J4.71)
BT_RST: 09 (R122.2 U19.34), 01 (J4.67)
BT_WAKE: 09 (R125.2 U19.6), 01 (J3.16)
GPIO0_B0: 13 (Q10.2 R144.2), 01 (J3.15)
GPIO1_C2: 02 (R10.2), 01 (J2.43)
GPIO1_C6: 07 (J27.8), 01 (J2.41)
GPIO4_D0_3V: 02 (R11.1), 01 (J5.38)
GPIO4_D5_3V: 13 (U23.8), 01 (J3.50)
HOST0_DM: 03 (ED6.1 J12.2), 01 (J2.76)
HOST0_DP: 03 (ED5.1 J12.3), 01 (J2.77)
HOST1_DM: 03 (U4.25), 01 (J2.79)
HOST1_DP: 03 (U4.26), 01 (J2.80)
HP_DET_H: 04 (C60.1 R35.2 R36.2), 01 (J4.36)
HUB_RST: 03 (R18.1 U4.13), 01 (J2.74)
I2C1_SCL: 04 (U8.35), 01 (J4.50)
I2C1_SDA: 04 (U8.36), 01 (J4.51)
I2C4_SCL: 07 (J27.11), 01 (J2.44)
I2C4_SDA: 07 (J27.12), 01 (J2.45)
I2S0_LRCK_RX: 04 (U8.32), 01 (J4.42 J4.43)
I2S0_SCLK: 04 (R32.1), 01 (J4.48)
I2S0_SDI0: 04 (U8.30), 01 (J4.41)
I2S0_SDO0: 04 (U8.31), 01 (J4.44)
I2S_CLK: 04 (R33.1), 01 (J4.49)
LCD_BL_PWM: 07 (J27.3), 01 (J3.53)
LCD_EN: 07 (J27.18 U17.3), 01 (J3.52)
LCD_RST: 07 (J27.4), 01 (J3.51)
MIPI_TX0_CLKN: 07 (J27.20), 01 (J4.14)
MIPI_TX0_CLKP: 07 (J27.19), 01 (J4.13)
MIPI_TX0_D0N: 07 (J27.22), 01 (J4.17)
MIPI_TX0_D0P: 07 (J27.21), 01 (J4.16)
MIPI_TX0_D1N: 07 (J27.24), 01 (J4.20)
MIPI_TX0_D1P: 07 (J27.23), 01 (J4.19)
MIPI_TX0_D2N: 07 (J27.28), 01 (J4.23)
MIPI_TX0_D2P: 07 (J27.27), 01 (J4.22)
MIPI_TX0_D3N: 07 (J27.30), 01 (J4.26)
MIPI_TX0_D3P: 07 (J27.29), 01 (J4.25)
RST_KEY: 02 (K2.1), 01 (R146.1)
RX2: 13 (D10.2 J42.3), 01 (J4.29)
SPI1_CLK: 13 (U23.3), 01 (J3.10)
SPI1_CSn0: 13 (U23.2), 01 (J3.11)
SPI1_RXD4: 13 (U22.4), 01 (J3.13)
SPI1_TXD4: 13 (U23.4), 01 (J3.12)
TOUCH_RST_L: 07 (J27.7), 01 (J2.42)
TX2: 13 (D11.2 J42.2), 01 (J4.28)
UART0_CTS: 09 (U19.41), 01 (J4.63)
UART0_RTS: 09 (U19.44), 01 (J4.66)
UART0_RXD: 09 (U19.42), 01 (J4.64)
UART0_TXD: 09 (U19.43), 01 (J4.65)
WIFI_CLK: 09 (R118.1), 01 (J4.54)
WIFI_CMD: 09 (R111.2 R117.1), 01 (J4.55)
WIFI_D0: 09 (R108.2 R113.1), 01 (J4.59)
WIFI_D1: 09 (R107.2 R114.1), 01 (J4.58)
WIFI_D2: 09 (R110.2 R115.1), 01 (J4.57)
WIFI_D3: 09 (R109.2 R116.1), 01 (J4.56)
WIFI_HOST_WAKE: 09 (R123.2 U19.13), 01 (J4.68)
WIFI_REG_ON: 09 (R121.2 U19.12), 01 (J4.69)
WIFIBT_32KIN: 09 (U19.24), 01 (J4.61)